# EAGLE design logicboard (EAGLE 7.5.0)

## Sheet 1 of 6: output interfaces
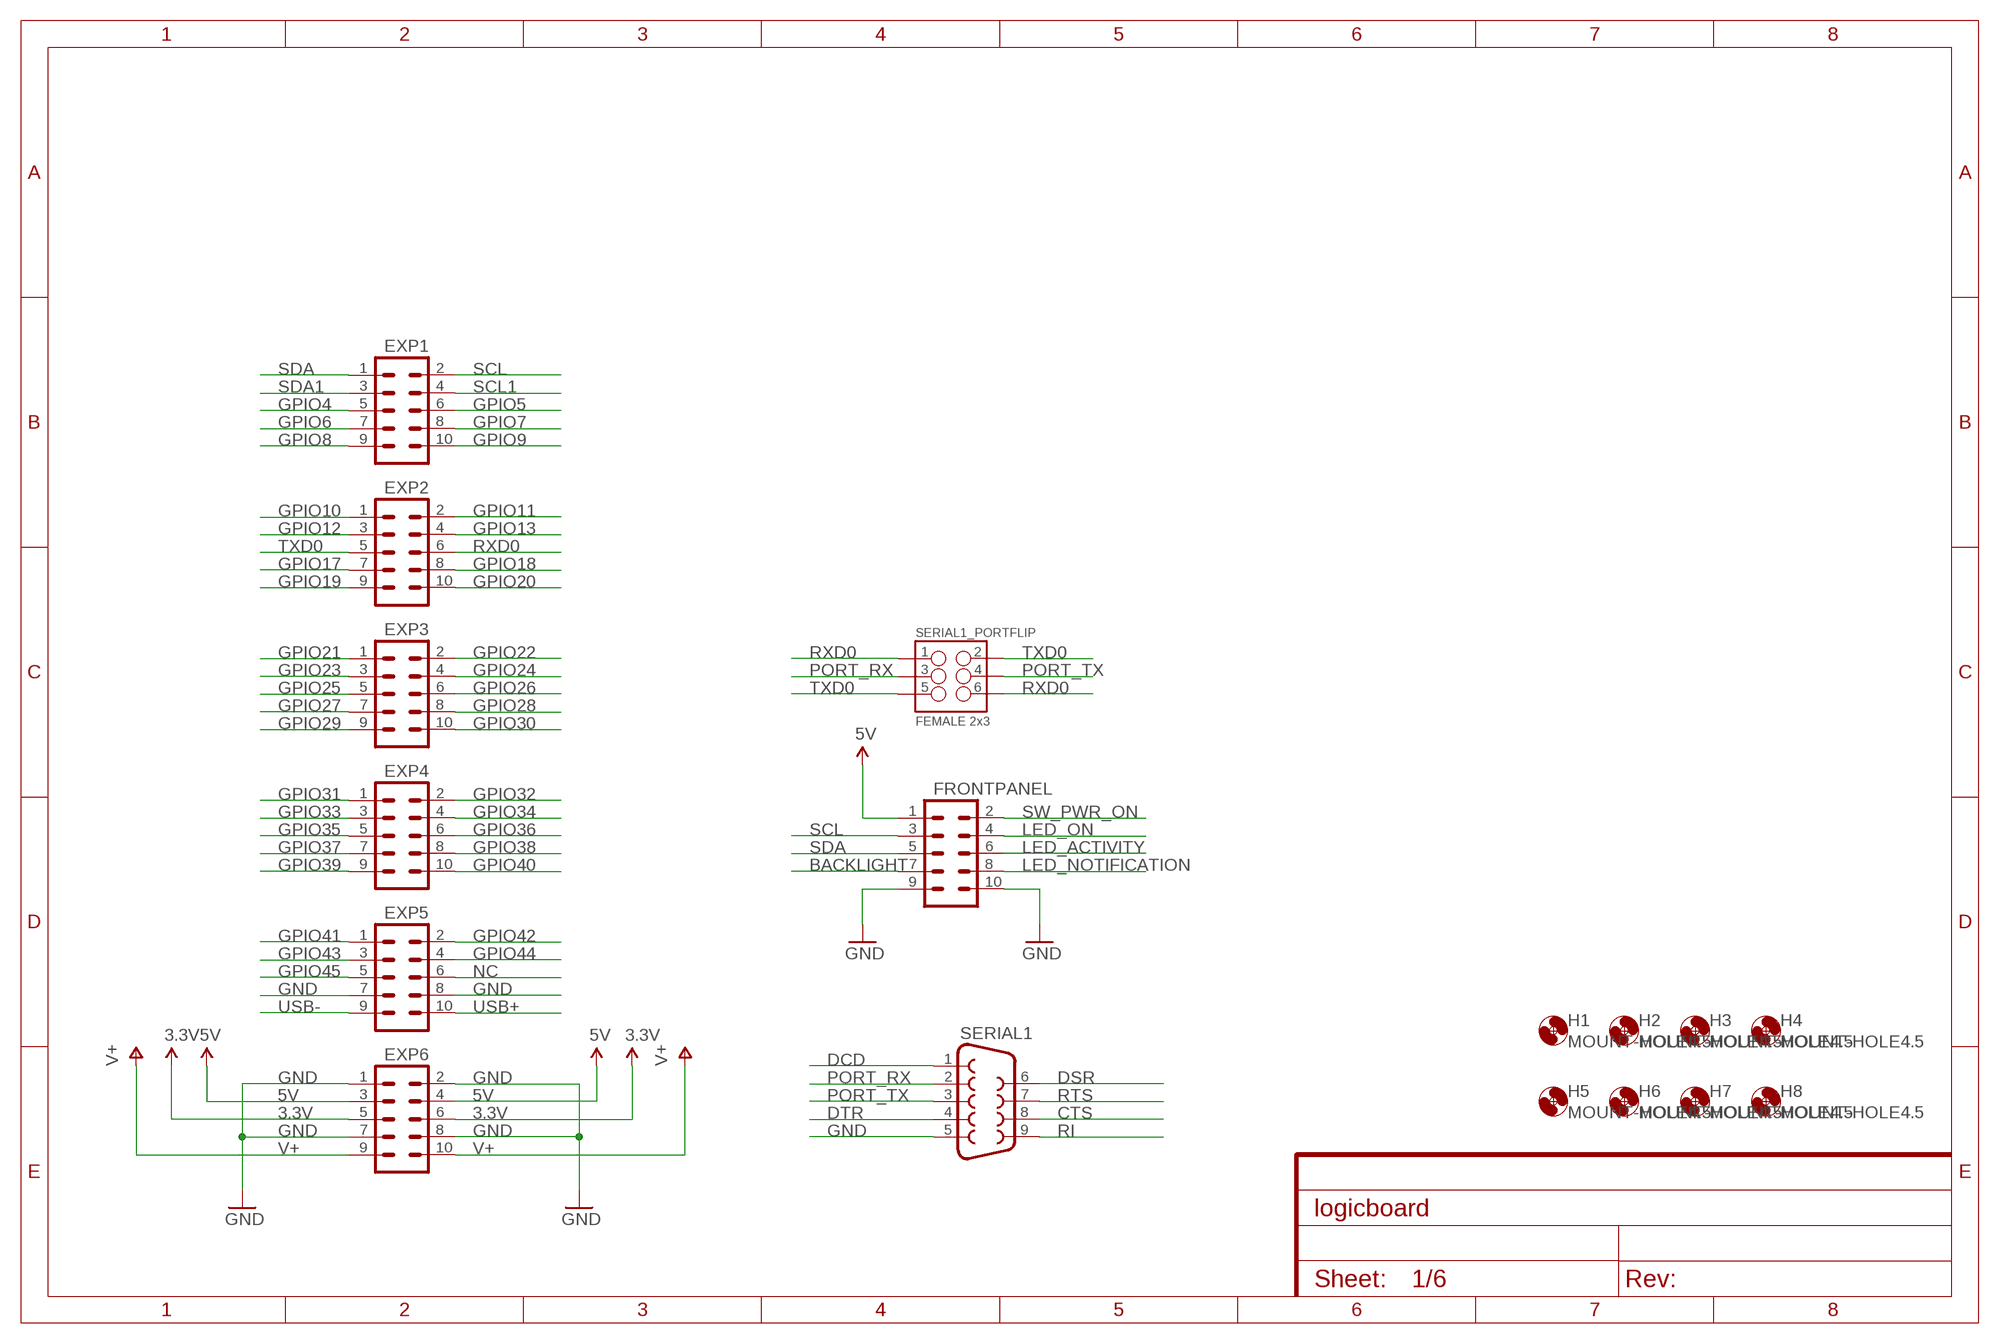
[diagram p0: schematic, sheet 1]

### Parts
EXP1  M05X2SHD_LOCK  [2X5-SHROUDED_LOCK]
EXP2  M05X2SHD_LOCK  [2X5-SHROUDED_LOCK]
EXP3  M05X2SHD_LOCK  [2X5-SHROUDED_LOCK]
EXP4  M05X2SHD_LOCK  [2X5-SHROUDED_LOCK]
EXP5  M05X2SHD_LOCK  [2X5-SHROUDED_LOCK]
EXP6  M05X2SHD_LOCK  [2X5-SHROUDED_LOCK]
FRONTPANEL  M05X2SHD_LOCK  [2X5-SHROUDED_LOCK]
H1  MOUNT-HOLE4.5  [4,5]
H2  MOUNT-HOLE4.5  [4,5]
H3  MOUNT-HOLE4.5  [4,5]
H4  MOUNT-HOLE4.5  [4,5]
H5  MOUNT-HOLE4.5  [4,5]
H6  MOUNT-HOLE4.5  [4,5]
H7  MOUNT-HOLE4.5  [4,5]
H8  MOUNT-HOLE4.5  [4,5]
SERIAL1  F09HP  [F09HP]
SERIAL1_PORTFLIP  FEMALE 2x3  M03X2FEMALE  [2X3]

### Nets
3.3V: EXP6.5 EXP6.6 ; also sheet 2,3,4,6
5V: EXP6.3 EXP6.4 FRONTPANEL.1 ; also sheet 2,4,5
BACKLIGHT: FRONTPANEL.7
CTS: SERIAL1.8
DCD: SERIAL1.1
DSR: SERIAL1.6
DTR: SERIAL1.4
GND: EXP5.7 EXP5.8 EXP6.1 EXP6.2 EXP6.7 EXP6.8 FRONTPANEL.9 FRONTPANEL.10 SERIAL1.5 ; also sheet 2,3,4,5,6
GPIO4: EXP1.5 ; also sheet 3
GPIO5: EXP1.6 ; also sheet 3
GPIO6: EXP1.7 ; also sheet 3
GPIO7: EXP1.8 ; also sheet 3
GPIO8: EXP1.9 ; also sheet 3
GPIO9: EXP1.10 ; also sheet 3
GPIO10: EXP2.1 ; also sheet 3
GPIO11: EXP2.2 ; also sheet 3
GPIO12: EXP2.3 ; also sheet 3
GPIO13: EXP2.4 ; also sheet 3
GPIO17: EXP2.7 ; also sheet 3
GPIO18: EXP2.8 ; also sheet 3
GPIO19: EXP2.9 ; also sheet 3
GPIO20: EXP2.10 ; also sheet 3
GPIO21: EXP3.1 ; also sheet 3
GPIO22: EXP3.2 ; also sheet 3
GPIO23: EXP3.3 ; also sheet 3
GPIO24: EXP3.4 ; also sheet 3
GPIO25: EXP3.5 ; also sheet 3
GPIO26: EXP3.6 ; also sheet 3
GPIO27: EXP3.7 ; also sheet 3
GPIO28: EXP3.8 ; also sheet 3
GPIO29: EXP3.9 ; also sheet 3
GPIO30: EXP3.10 ; also sheet 3
GPIO31: EXP4.1 ; also sheet 3
GPIO32: EXP4.2 ; also sheet 3
GPIO33: EXP4.3 ; also sheet 3
GPIO34: EXP4.4 ; also sheet 3
GPIO35: EXP4.5 ; also sheet 3
GPIO36: EXP4.6 ; also sheet 3
GPIO37: EXP4.7 ; also sheet 3
GPIO38: EXP4.8 ; also sheet 3
GPIO39: EXP4.9 ; also sheet 3
GPIO40: EXP4.10 ; also sheet 3,5
GPIO41: EXP5.1 ; also sheet 3,5
GPIO42: EXP5.2 ; also sheet 3
GPIO43: EXP5.3 ; also sheet 3
GPIO44: EXP5.4 ; also sheet 3
GPIO45: EXP5.5 ; also sheet 3
LED_ACTIVITY: FRONTPANEL.6
LED_NOTIFICATION: FRONTPANEL.8 ; also sheet 6
LED_ON: FRONTPANEL.4
NC: EXP5.6
PORT_RX: SERIAL1.2 SERIAL1_PORTFLIP.3
PORT_TX: SERIAL1.3 SERIAL1_PORTFLIP.4
RI: SERIAL1.9
RTS: SERIAL1.7
RXD0: EXP2.6 SERIAL1_PORTFLIP.1 SERIAL1_PORTFLIP.6 ; also sheet 3
SCL: EXP1.2 FRONTPANEL.3 ; also sheet 2,3,6
SCL1: EXP1.4 ; also sheet 3
SDA: EXP1.1 FRONTPANEL.5 ; also sheet 2,3,6
SDA1: EXP1.3 ; also sheet 3
SW_PWR_ON: FRONTPANEL.2
TXD0: EXP2.5 SERIAL1_PORTFLIP.2 SERIAL1_PORTFLIP.5 ; also sheet 3
USB+: EXP5.10 ; also sheet 3
USB-: EXP5.9 ; also sheet 3
V+: EXP6.9 EXP6.10 ; also sheet 4

## Sheet 2 of 6: i2c devices
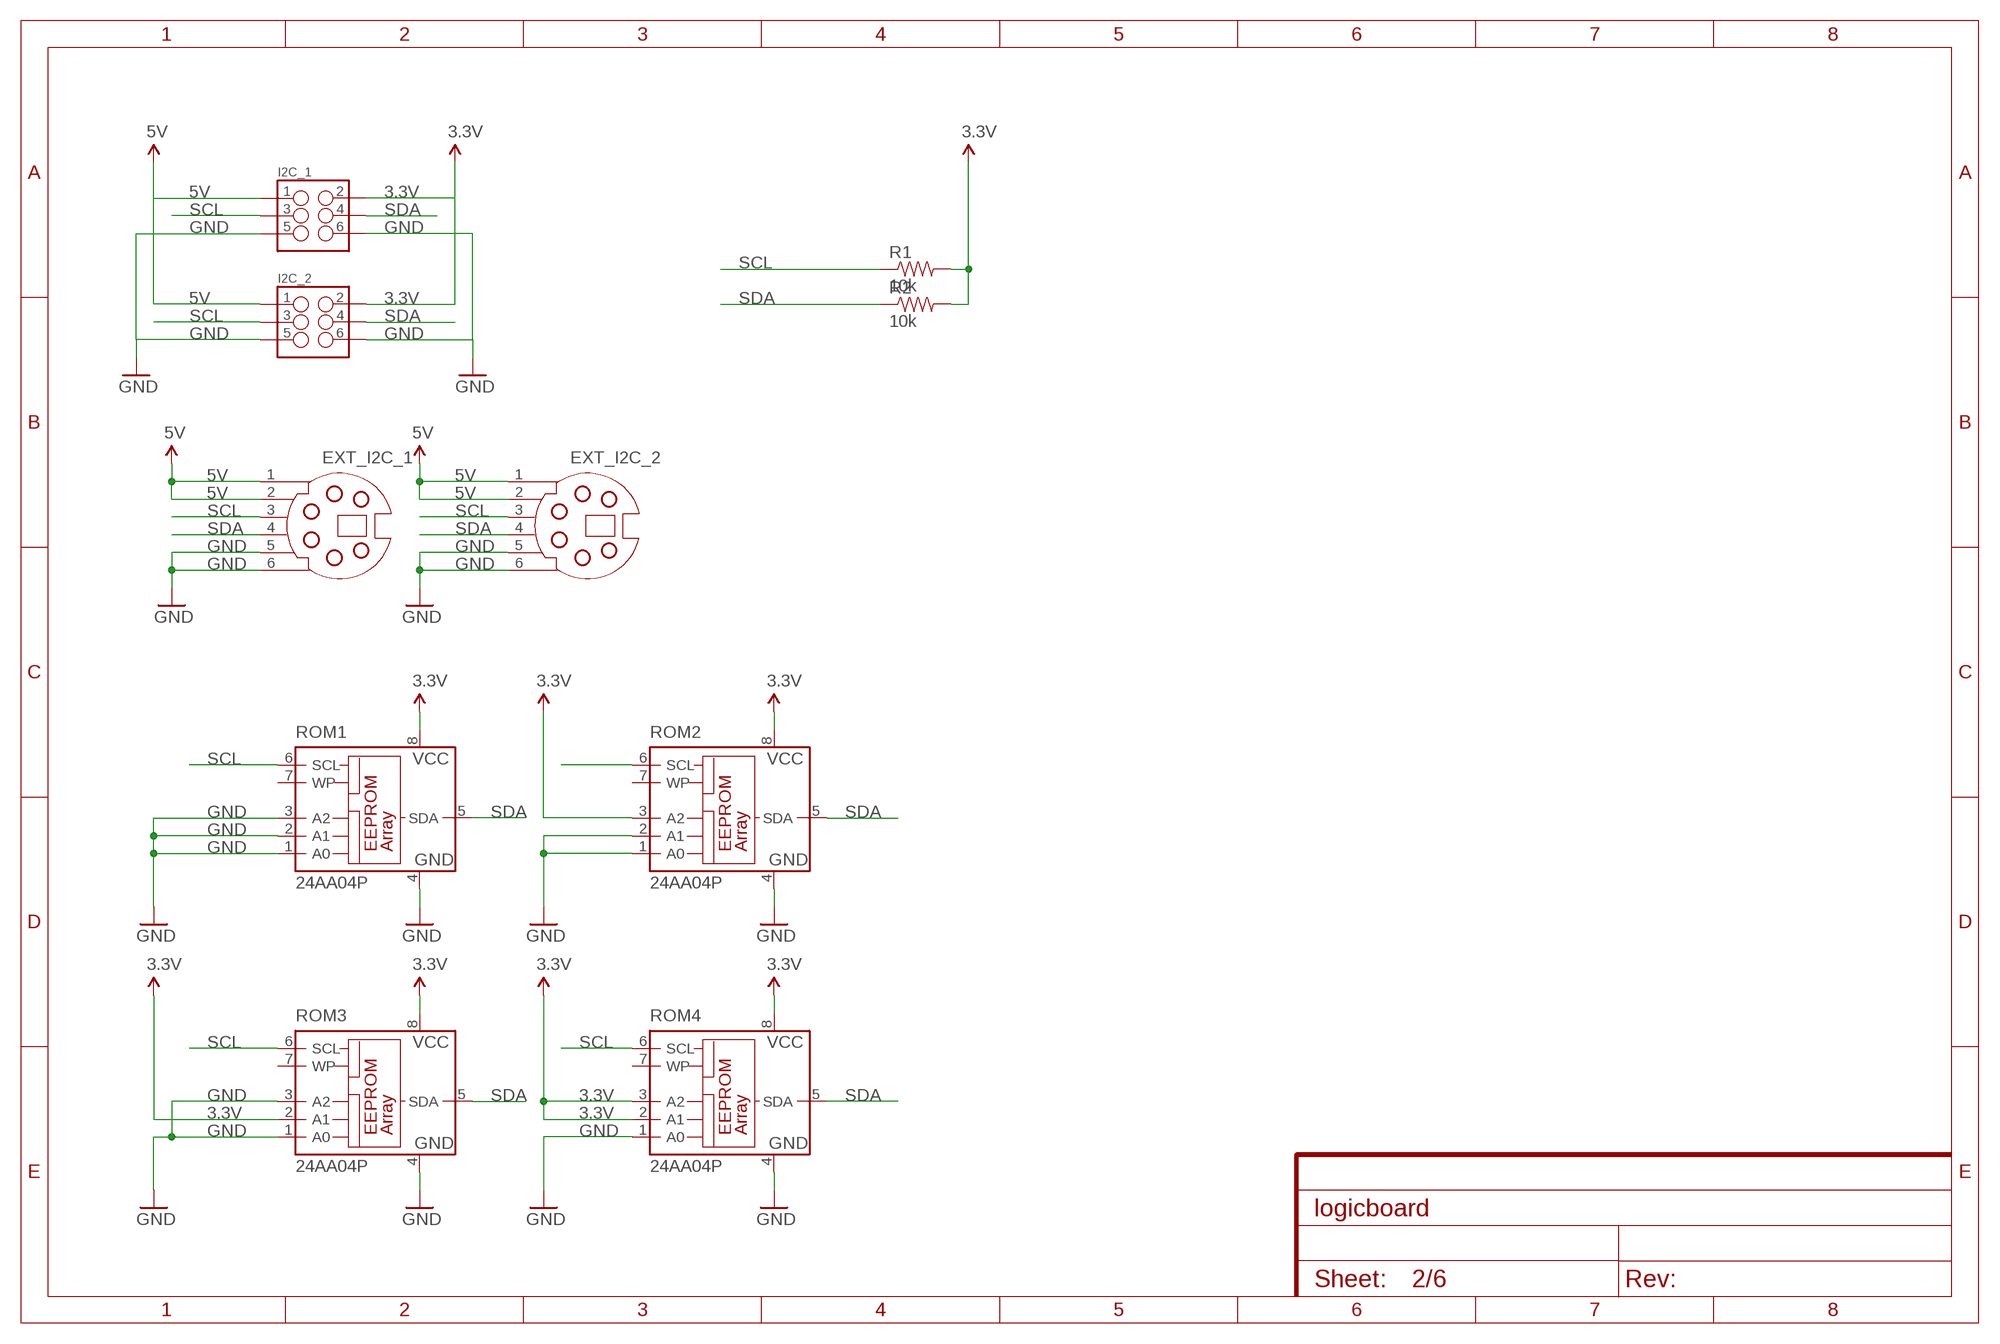
[diagram p1: schematic, sheet 2]

### Parts
EXT_I2C_1  MDSSV-BC06  [SSV-BC06]
EXT_I2C_2  MDSSV-BC06  [SSV-BC06]
I2C_1  M03X2SHROUD  [2X3-SHROUDED]
I2C_2  M03X2SHROUD  [2X3-SHROUDED]
R1  10k  10KOHM-1/4W-1%(PTH)HORIZ-KIT  [AXIAL-0.3EZ]
R2  10k  10KOHM-1/4W-1%(PTH)HORIZ-KIT  [AXIAL-0.3EZ]
ROM1  24AA04P  [DIL8]
ROM2  24AA04P  [DIL8]
ROM3  24AA04P  [DIL8]
ROM4  24AA04P  [DIL8]

### Nets
3.3V: I2C_1.2 I2C_2.2 R1.P$2 R2.P$2 ROM1.8(VCC) ROM2.3(A2) ROM2.8(VCC) ROM3.2(A1) ROM3.8(VCC) ROM4.2(A1) ROM4.3(A2) ROM4.8(VCC) ; also sheet 1,3,4,6
5V: EXT_I2C_1.1 EXT_I2C_1.2 EXT_I2C_2.1 EXT_I2C_2.2 I2C_1.1 I2C_2.1 ; also sheet 1,4,5
GND: EXT_I2C_1.5 EXT_I2C_1.6 EXT_I2C_2.5 EXT_I2C_2.6 I2C_1.5 I2C_1.6 I2C_2.5 I2C_2.6 ROM1.1(A0) ROM1.2(A1) ROM1.3(A2) ROM1.4(GND) ROM2.1(A0) ROM2.2(A1) ROM2.4(GND) ROM3.1(A0) ROM3.3(A2) ROM3.4(GND) ROM4.1(A0) ROM4.4(GND) ; also sheet 1,3,4,5,6
SCL: EXT_I2C_1.3 EXT_I2C_2.3 I2C_1.3 I2C_2.3 R1.P$1 ROM1.6(SCL) ROM2.6(SCL) ROM3.6(SCL) ROM4.6(SCL) ; also sheet 1,3,6
SDA: EXT_I2C_1.4 EXT_I2C_2.4 I2C_1.4 I2C_2.4 R2.P$1 ROM1.5(SDA) ROM2.5(SDA) ROM3.5(SDA) ROM4.5(SDA) ; also sheet 1,3,6
Unconnected: ROM1.7(WP) ROM2.7(WP) ROM3.7(WP) ROM4.7(WP)

## Sheet 3 of 6: Microprocessor card
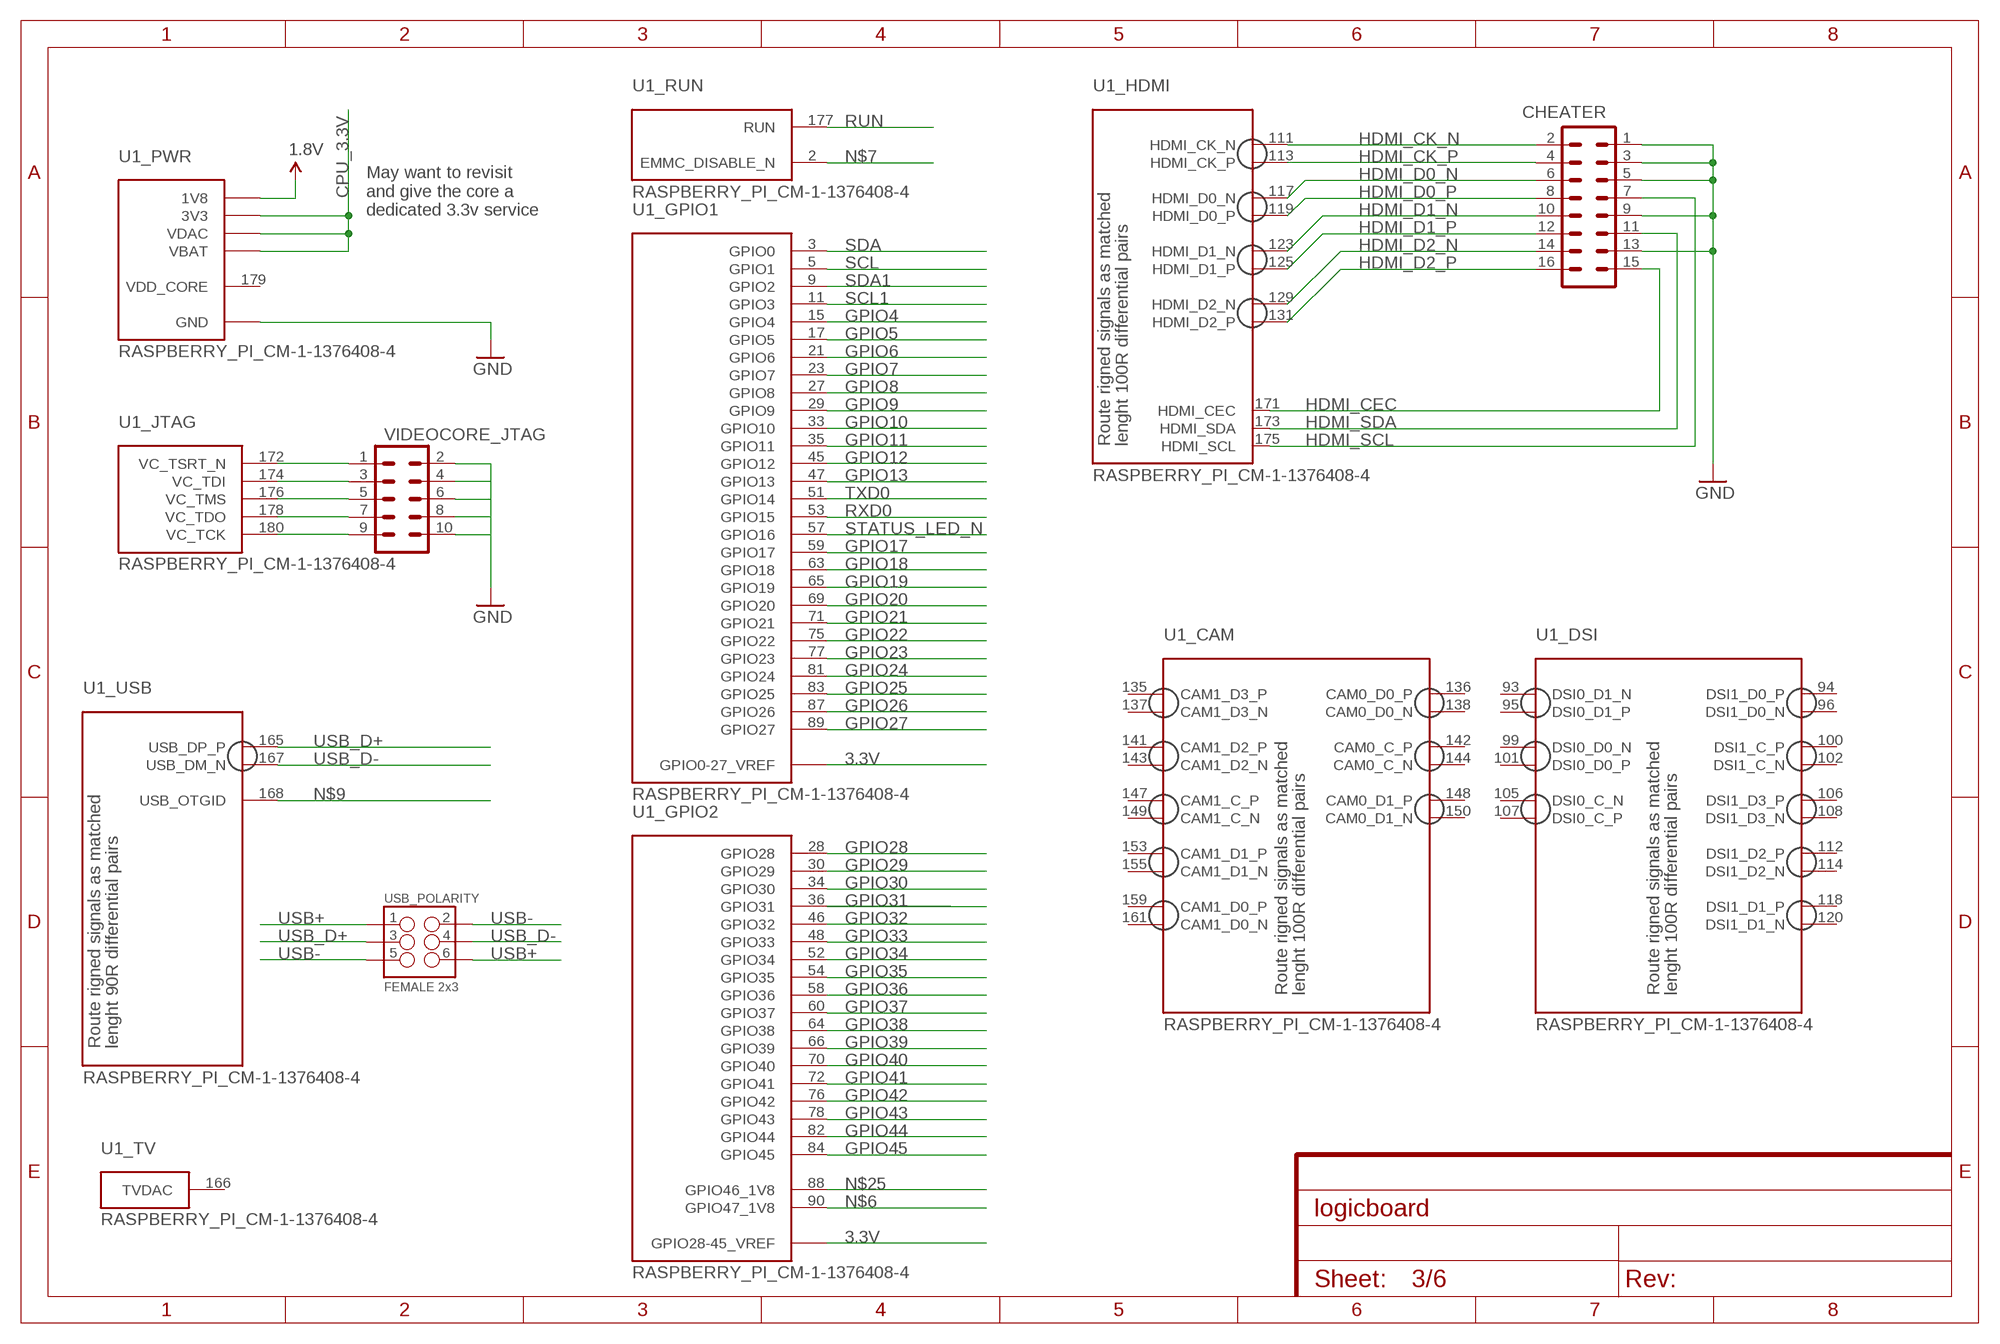
[diagram p2: schematic, sheet 3]

### Parts
CHEATER  M08X2  [2X8]
U1  RASPBERRY_PI_CM-1-1376408-4  [1-1376408-4]
USB_POLARITY  FEMALE 2x3  M03X2FEMALE  [2X3]
VIDEOCORE_JTAG  M05X2SHD_LOCK  [2X5-SHROUDED_LOCK]

### Nets
1.8V: U1.183(_PWR:1V8) U1.184(_PWR:1V8) U1.185(_PWR:1V8) U1.186(_PWR:1V8) ; also sheet 4
3.3V: U1.39(_GPIO1:GPIO0-27_VREF) U1.40(_GPIO1:GPIO0-27_VREF) U1.41(_GPIO2:GPIO28-45_VREF) U1.42(_GPIO2:GPIO28-45_VREF) ; also sheet 1,2,4,6
CPU_3.3V: U1.189(_PWR:VDAC) U1.190(_PWR:VDAC) U1.191(_PWR:3V3) U1.192(_PWR:3V3) U1.193(_PWR:3V3) U1.194(_PWR:3V3) U1.197(_PWR:VBAT) U1.198(_PWR:VBAT) U1.199(_PWR:VBAT) U1.200(_PWR:VBAT) ; also sheet 4
GND: CHEATER.1 CHEATER.3 CHEATER.5 CHEATER.9 CHEATER.13 U1.1(_PWR:GND) U1.7(_PWR:GND) U1.13(_PWR:GND) U1.19(_PWR:GND) U1.25(_PWR:GND) U1.26(_PWR:GND) U1.31(_PWR:GND) U1.32(_PWR:GND) U1.37(_PWR:GND) U1.38(_PWR:GND) U1.43(_PWR:GND) U1.44(_PWR:GND) U1.49(_PWR:GND) U1.50(_PWR:GND) U1.55(_PWR:GND) U1.56(_PWR:GND) U1.61(_PWR:GND) U1.62(_PWR:GND) U1.67(_PWR:GND) U1.68(_PWR:GND) U1.73(_PWR:GND) U1.74(_PWR:GND) U1.79(_PWR:GND) U1.80(_PWR:GND) U1.85(_PWR:GND) U1.86(_PWR:GND) U1.91(_PWR:GND) U1.92(_PWR:GND) U1.97(_PWR:GND) U1.98(_PWR:GND) U1.103(_PWR:GND) U1.104(_PWR:GND) U1.109(_PWR:GND) U1.110(_PWR:GND) U1.115(_PWR:GND) U1.116(_PWR:GND) U1.121(_PWR:GND) U1.122(_PWR:GND) U1.127(_PWR:GND) U1.133(_PWR:GND) U1.134(_PWR:GND) U1.139(_PWR:GND) U1.140(_PWR:GND) U1.145(_PWR:GND) U1.146(_PWR:GND) U1.151(_PWR:GND) U1.152(_PWR:GND) U1.157(_PWR:GND) U1.163(_PWR:GND) U1.164(_PWR:GND) U1.169(_PWR:GND) U1.170(_PWR:GND) U1.181(_PWR:GND) U1.182(_PWR:GND) U1.187(_PWR:GND) U1.188(_PWR:GND) U1.195(_PWR:GND) U1.196(_PWR:GND) VIDEOCORE_JTAG.2 VIDEOCORE_JTAG.4 VIDEOCORE_JTAG.6 VIDEOCORE_JTAG.8 VIDEOCORE_JTAG.10 ; also sheet 1,2,4,5,6
GPIO4: U1.15(_GPIO1:GPIO4) ; also sheet 1
GPIO5: U1.17(_GPIO1:GPIO5) ; also sheet 1
GPIO6: U1.21(_GPIO1:GPIO6) ; also sheet 1
GPIO7: U1.23(_GPIO1:GPIO7) ; also sheet 1
GPIO8: U1.27(_GPIO1:GPIO8) ; also sheet 1
GPIO9: U1.29(_GPIO1:GPIO9) ; also sheet 1
GPIO10: U1.33(_GPIO1:GPIO10) ; also sheet 1
GPIO11: U1.35(_GPIO1:GPIO11) ; also sheet 1
GPIO12: U1.45(_GPIO1:GPIO12) ; also sheet 1
GPIO13: U1.47(_GPIO1:GPIO13) ; also sheet 1
GPIO17: U1.59(_GPIO1:GPIO17) ; also sheet 1
GPIO18: U1.63(_GPIO1:GPIO18) ; also sheet 1
GPIO19: U1.65(_GPIO1:GPIO19) ; also sheet 1
GPIO20: U1.69(_GPIO1:GPIO20) ; also sheet 1
GPIO21: U1.71(_GPIO1:GPIO21) ; also sheet 1
GPIO22: U1.75(_GPIO1:GPIO22) ; also sheet 1
GPIO23: U1.77(_GPIO1:GPIO23) ; also sheet 1
GPIO24: U1.81(_GPIO1:GPIO24) ; also sheet 1
GPIO25: U1.83(_GPIO1:GPIO25) ; also sheet 1
GPIO26: U1.87(_GPIO1:GPIO26) ; also sheet 1
GPIO27: U1.89(_GPIO1:GPIO27) ; also sheet 1
GPIO28: U1.28(_GPIO2:GPIO28) ; also sheet 1
GPIO29: U1.30(_GPIO2:GPIO29) ; also sheet 1
GPIO30: U1.34(_GPIO2:GPIO30) ; also sheet 1
GPIO31: U1.36(_GPIO2:GPIO31) ; also sheet 1
GPIO32: U1.46(_GPIO2:GPIO32) ; also sheet 1
GPIO33: U1.48(_GPIO2:GPIO33) ; also sheet 1
GPIO34: U1.52(_GPIO2:GPIO34) ; also sheet 1
GPIO35: U1.54(_GPIO2:GPIO35) ; also sheet 1
GPIO36: U1.58(_GPIO2:GPIO36) ; also sheet 1
GPIO37: U1.60(_GPIO2:GPIO37) ; also sheet 1
GPIO38: U1.64(_GPIO2:GPIO38) ; also sheet 1
GPIO39: U1.66(_GPIO2:GPIO39) ; also sheet 1
GPIO40: U1.70(_GPIO2:GPIO40) ; also sheet 1,5
GPIO41: U1.72(_GPIO2:GPIO41) ; also sheet 1,5
GPIO42: U1.76(_GPIO2:GPIO42) ; also sheet 1
GPIO43: U1.78(_GPIO2:GPIO43) ; also sheet 1
GPIO44: U1.82(_GPIO2:GPIO44) ; also sheet 1
GPIO45: U1.84(_GPIO2:GPIO45) ; also sheet 1
HDMI_CEC: CHEATER.15 U1.171(_HDMI:HDMI_CEC)
HDMI_CK_N: CHEATER.2 U1.111(_HDMI:HDMI_CK_N)
HDMI_CK_P: CHEATER.4 U1.113(_HDMI:HDMI_CK_P)
HDMI_D0_N: CHEATER.6 U1.117(_HDMI:HDMI_D0_N)
HDMI_D0_P: CHEATER.8 U1.119(_HDMI:HDMI_D0_P)
HDMI_D1_N: CHEATER.10 U1.123(_HDMI:HDMI_D1_N)
HDMI_D1_P: CHEATER.12 U1.125(_HDMI:HDMI_D1_P)
HDMI_D2_N: CHEATER.14 U1.129(_HDMI:HDMI_D2_N)
HDMI_D2_P: CHEATER.16 U1.131(_HDMI:HDMI_D2_P)
HDMI_SCL: CHEATER.7 U1.175(_HDMI:HDMI_SCL)
HDMI_SDA: CHEATER.11 U1.173(_HDMI:HDMI_SDA)
N$1: U1.180(_JTAG:VC_TCK) VIDEOCORE_JTAG.9
N$2: U1.178(_JTAG:VC_TDO) VIDEOCORE_JTAG.7
N$3: U1.176(_JTAG:VC_TMS) VIDEOCORE_JTAG.5
N$4: U1.174(_JTAG:VC_TDI) VIDEOCORE_JTAG.3
N$5: U1.172(_JTAG:VC_TSRT_N) VIDEOCORE_JTAG.1
N$6: U1.90(_GPIO2:GPIO47_1V8)
N$7: U1.2(_RUN:EMMC_DISABLE_N)
N$9: U1.168(_USB:USB_OTGID)
N$25: U1.88(_GPIO2:GPIO46_1V8)
RUN: U1.177(_RUN:RUN)
RXD0: U1.53(_GPIO1:GPIO15) ; also sheet 1
SCL: U1.5(_GPIO1:GPIO1) ; also sheet 1,2,6
SCL1: U1.11(_GPIO1:GPIO3) ; also sheet 1
SDA: U1.3(_GPIO1:GPIO0) ; also sheet 1,2,6
SDA1: U1.9(_GPIO1:GPIO2) ; also sheet 1
STATUS_LED_N: U1.57(_GPIO1:GPIO16)
TXD0: U1.51(_GPIO1:GPIO14) ; also sheet 1
USB+: USB_POLARITY.1 USB_POLARITY.6 ; also sheet 1
USB-: USB_POLARITY.2 USB_POLARITY.5 ; also sheet 1
USB_D+: U1.165(_USB:USB_DP_P) USB_POLARITY.3
USB_D-: U1.167(_USB:USB_DM_N) USB_POLARITY.4
Unconnected: U1.93(_DSI:DSI0_D1_N) U1.94(_DSI:DSI1_D0_P) U1.95(_DSI:DSI0_D1_P) U1.96(_DSI:DSI1_D0_N) U1.99(_DSI:DSI0_D0_N) U1.100(_DSI:DSI1_C_P) U1.101(_DSI:DSI0_D0_P) U1.102(_DSI:DSI1_C_N) U1.105(_DSI:DSI0_C_N) U1.106(_DSI:DSI1_D3_P) U1.107(_DSI:DSI0_C_P) U1.108(_DSI:DSI1_D3_N) U1.112(_DSI:DSI1_D2_P) U1.114(_DSI:DSI1_D2_N) U1.118(_DSI:DSI1_D1_P) U1.120(_DSI:DSI1_D1_N) U1.135(_CAM:CAM1_D3_P) U1.136(_CAM:CAM0_D0_P) U1.137(_CAM:CAM1_D3_N) U1.138(_CAM:CAM0_D0_N) U1.141(_CAM:CAM1_D2_P) U1.142(_CAM:CAM0_C_P) U1.143(_CAM:CAM1_D2_N) U1.144(_CAM:CAM0_C_N) U1.147(_CAM:CAM1_C_P) U1.148(_CAM:CAM0_D1_P) U1.149(_CAM:CAM1_C_N) U1.150(_CAM:CAM0_D1_N) U1.153(_CAM:CAM1_D1_P) U1.155(_CAM:CAM1_D1_N) U1.159(_CAM:CAM1_D0_P) U1.161(_CAM:CAM1_D0_N) U1.166(_TV:TVDAC) U1.179(_PWR:VDD_CORE)

### Notes on the sheet
- May want to revisit 
  and give the core a 
  dedicated 3.3v service

## Sheet 4 of 6: Power Regulation
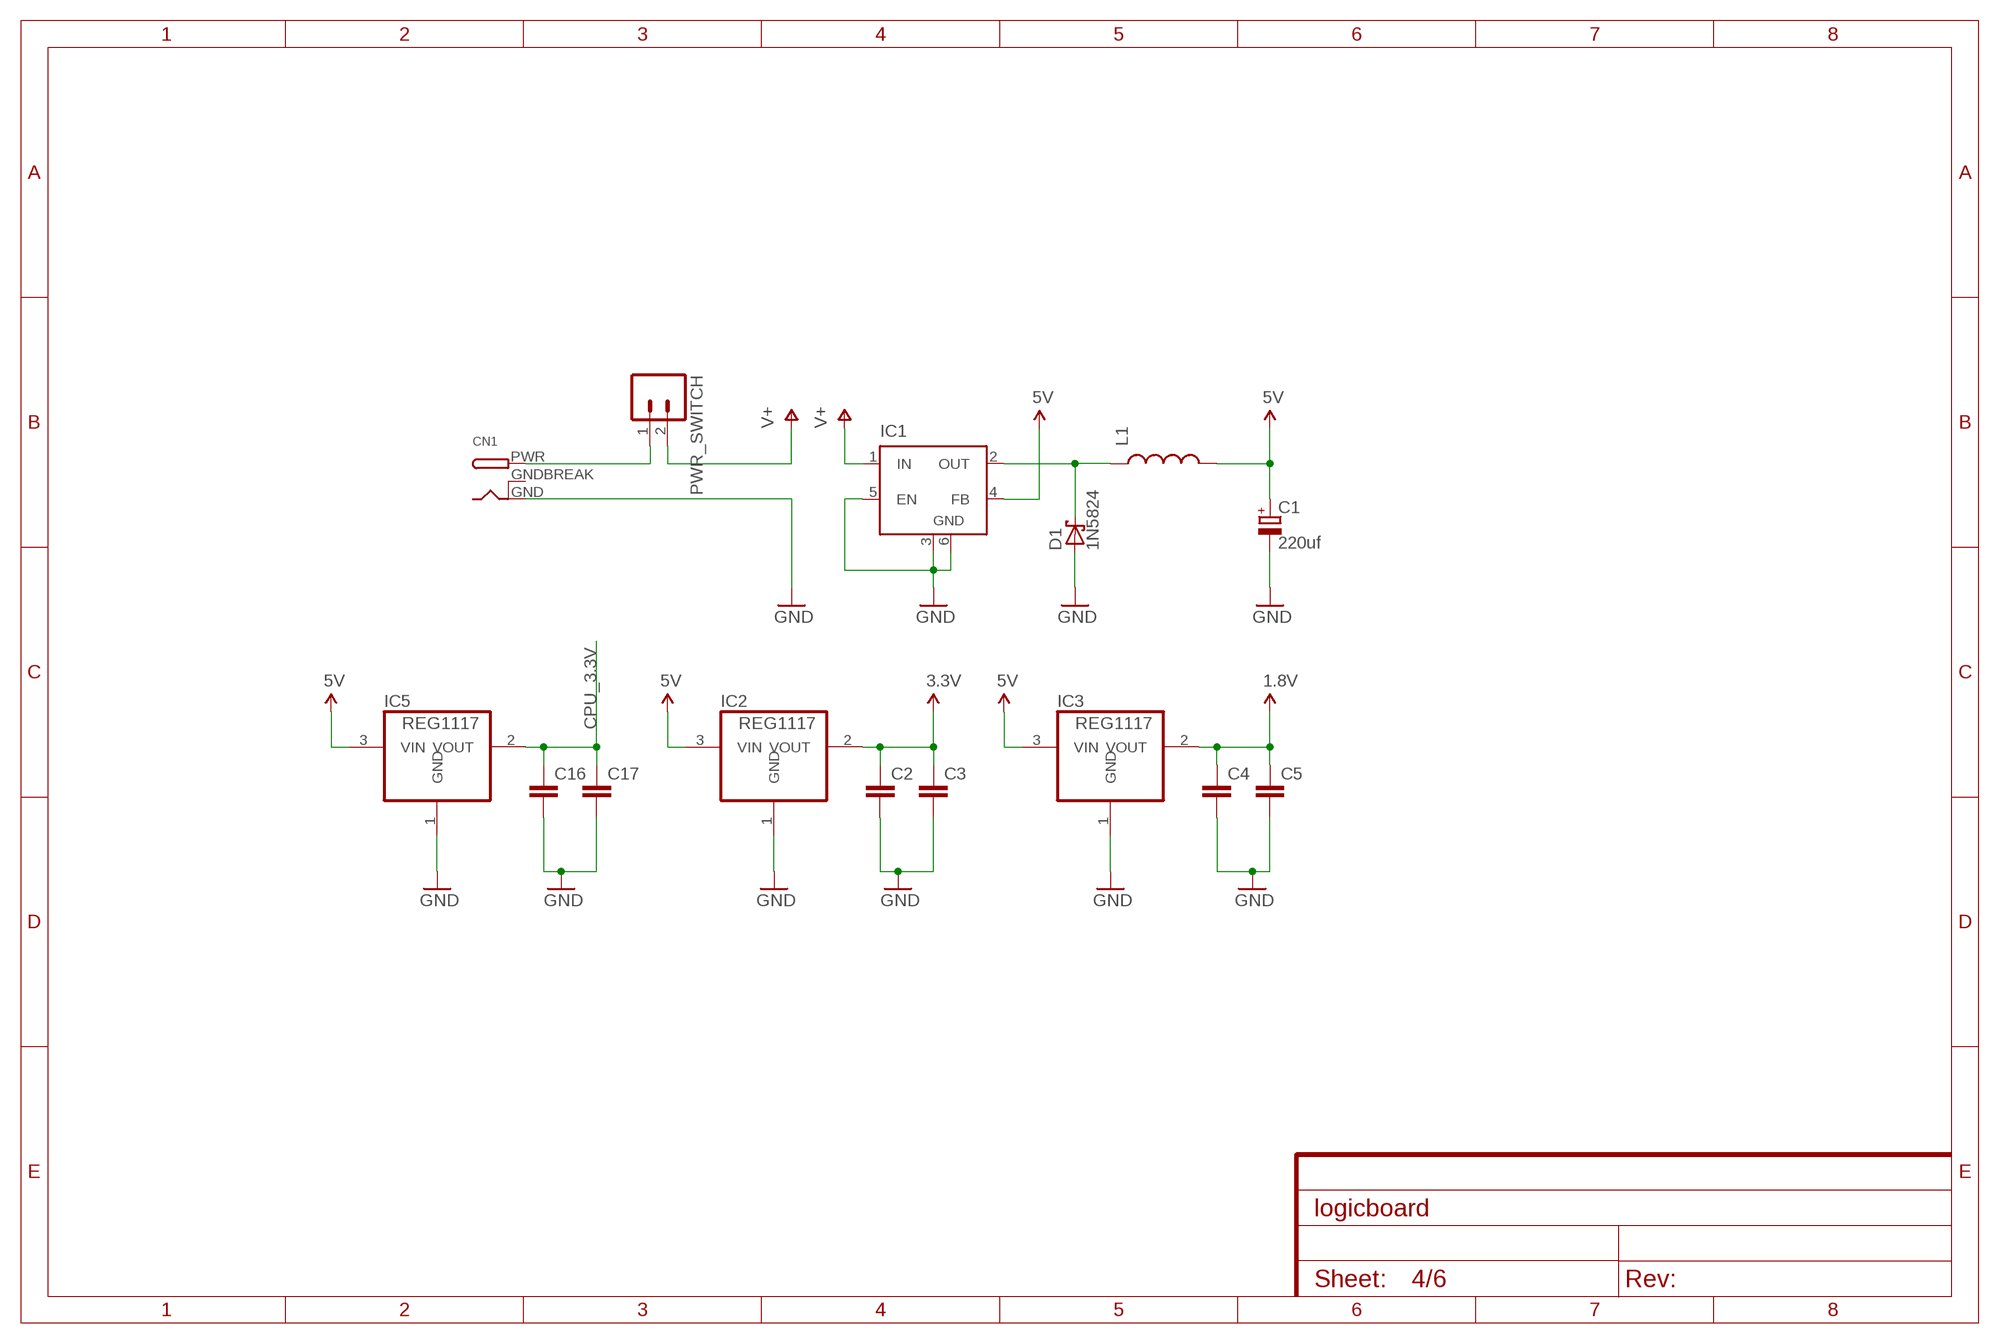
[diagram p3: schematic, sheet 4]

### Parts
C1  220uf  CPOL-EUE2.5-6  [E2,5-6]
C2  CAP1206  [1206]
C3  CAP1206  [1206]
C4  CAP1206  [1206]
C5  CAP1206  [1206]
C16  CAP1206  [1206]
C17  CAP1206  [1206]
CN1  DCBARRELPTH  [DCJACK_2MM_PTH]
D1  1N5824  1N5817-B  [DO41-7.6]
IC1  LM2596S  [TO263-5]
IC2  REG1117  [SOT223]
IC3  REG1117  [SOT223]
IC5  REG1117  [SOT223]
L1  INDUCTORSRU1038  [SRU1038]
PWR_SWITCH  M02POLAR  [MOLEX-1X2]

### Nets
1.8V: C4.1 C5.1 IC3.2(VOUT) ; also sheet 3
3.3V: C2.1 C3.1 IC2.2(VOUT) ; also sheet 1,2,3,6
5V: C1.+ IC1.4(FB) IC2.3(VIN) IC3.3(VIN) IC5.3(VIN) L1.2 ; also sheet 1,2,5
CPU_3.3V: C16.1 C17.1 IC5.2(VOUT) ; also sheet 3
GND: C1.- C2.2 C3.2 C4.2 C5.2 C16.2 C17.2 CN1.GND D1.A IC1.3(GND) IC1.5(EN) IC1.6(GND) IC2.1(GND) IC3.1(GND) IC5.1(GND) ; also sheet 1,2,3,5,6
N$8: CN1.PWR PWR_SWITCH.1
V+: IC1.1(IN) PWR_SWITCH.2 ; also sheet 1
VOUT: D1.C IC1.2(OUT) L1.1

## Sheet 5 of 6: Audio
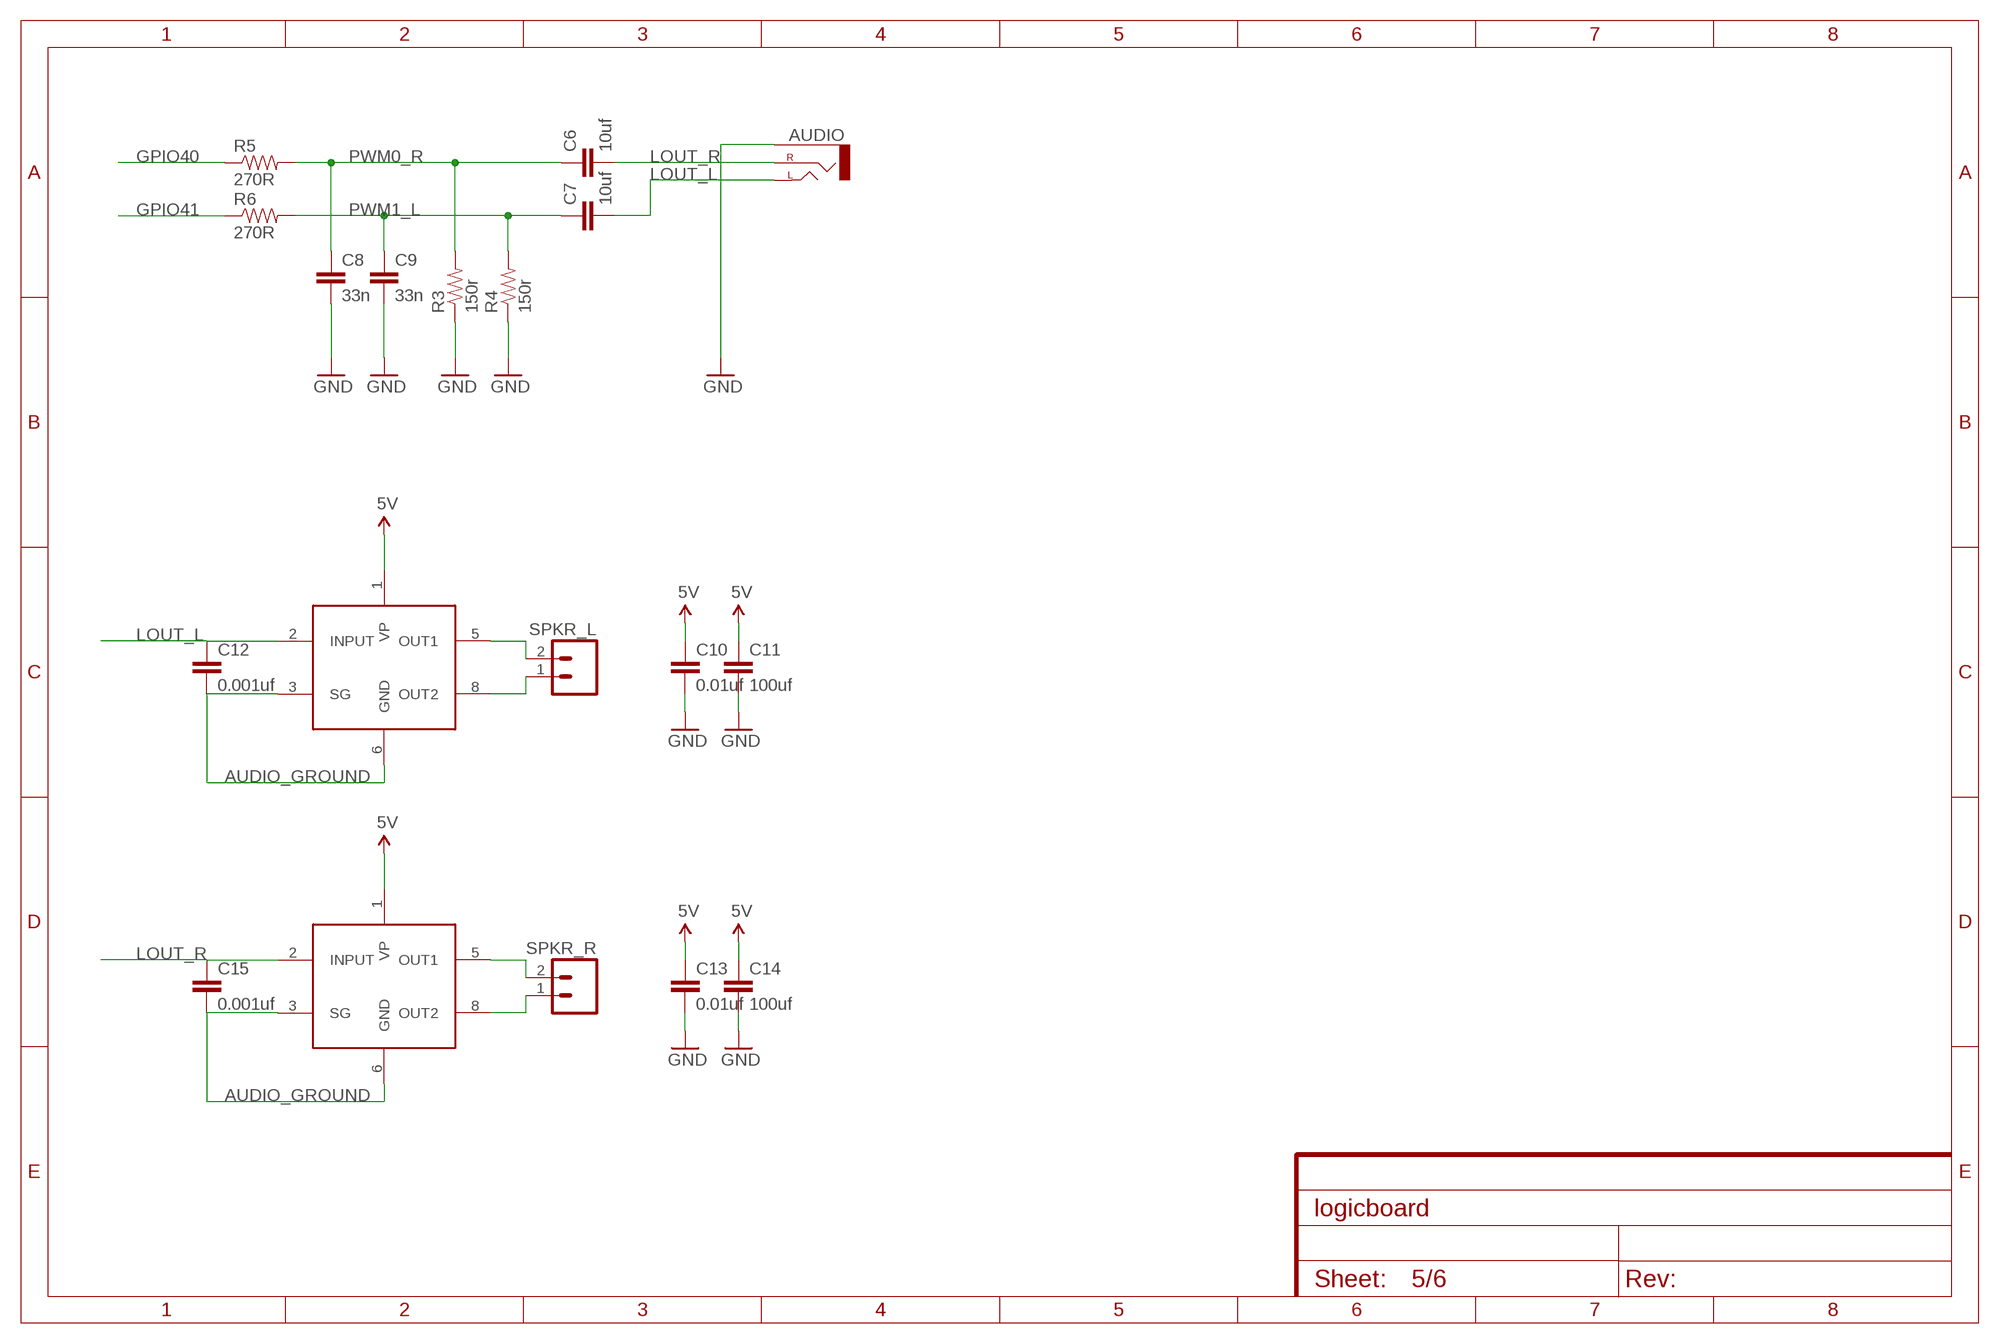
[diagram p4: schematic, sheet 5]

### Parts
AUDIO  AUDIO-JACKPTH  [AUDIO-JACK]
C6  10uf  CAPEZ  [CAP-PTH-SMALLEZ]
C7  10uf  CAPEZ  [CAP-PTH-SMALLEZ]
C8  33n  CAPEZ  [CAP-PTH-SMALLEZ]
C9  33n  CAPEZ  [CAP-PTH-SMALLEZ]
C10  0.01uf  CAPEZ  [CAP-PTH-SMALLEZ]
C11  100uf  CAPEZ  [CAP-PTH-SMALLEZ]
C12  0.001uf  CAPEZ  [CAP-PTH-SMALLEZ]
C13  0.01uf  CAPEZ  [CAP-PTH-SMALLEZ]
C14  100uf  CAPEZ  [CAP-PTH-SMALLEZ]
C15  0.001uf  CAPEZ  [CAP-PTH-SMALLEZ]
R3  150r  RESISTOREZ  [AXIAL-0.3EZ]
R4  150r  RESISTOREZ  [AXIAL-0.3EZ]
R5  270R  RESISTOREZ  [AXIAL-0.3EZ]
R6  270R  RESISTOREZ  [AXIAL-0.3EZ]
SPKR_L  M02JST-PTH-2-KIT  [JST-2-PTH-KIT]
SPKR_R  M02JST-PTH-2-KIT  [JST-2-PTH-KIT]
U$1  TDA7052  [DIL08]
U$2  TDA7052  [DIL08]

### Nets
5V: C10.1 C11.1 C13.1 C14.1 U$1.1(VP) U$2.1(VP) ; also sheet 1,2,4
AUDIO_GROUND: C12.2 C15.2 U$1.3(SG) U$1.6(GND) U$2.3(SG) U$2.6(GND) ; also sheet 6
GND: AUDIO.SLEEVE C8.2 C9.2 C10.2 C11.2 C13.2 C14.2 R3.P$1 R4.P$1 ; also sheet 1,2,3,4,6
GPIO40: R5.P$1 ; also sheet 1,3
GPIO41: R6.P$1 ; also sheet 1,3
LOUT_L: AUDIO.TIP(LEFT) C7.2 C12.1 U$1.2(INPUT)
LOUT_R: AUDIO.RING(RIGHT) C6.2 C15.1 U$2.2(INPUT)
N$10: SPKR_L.2 U$1.5(OUT1)
N$11: SPKR_L.1 U$1.8(OUT2)
N$22: SPKR_R.2 U$2.5(OUT1)
N$23: SPKR_R.1 U$2.8(OUT2)
PWM0_R: C6.1 C8.1 R3.P$2 R5.P$2
PWM1_L: C7.1 C9.1 R4.P$2 R6.P$2

## Sheet 6 of 6
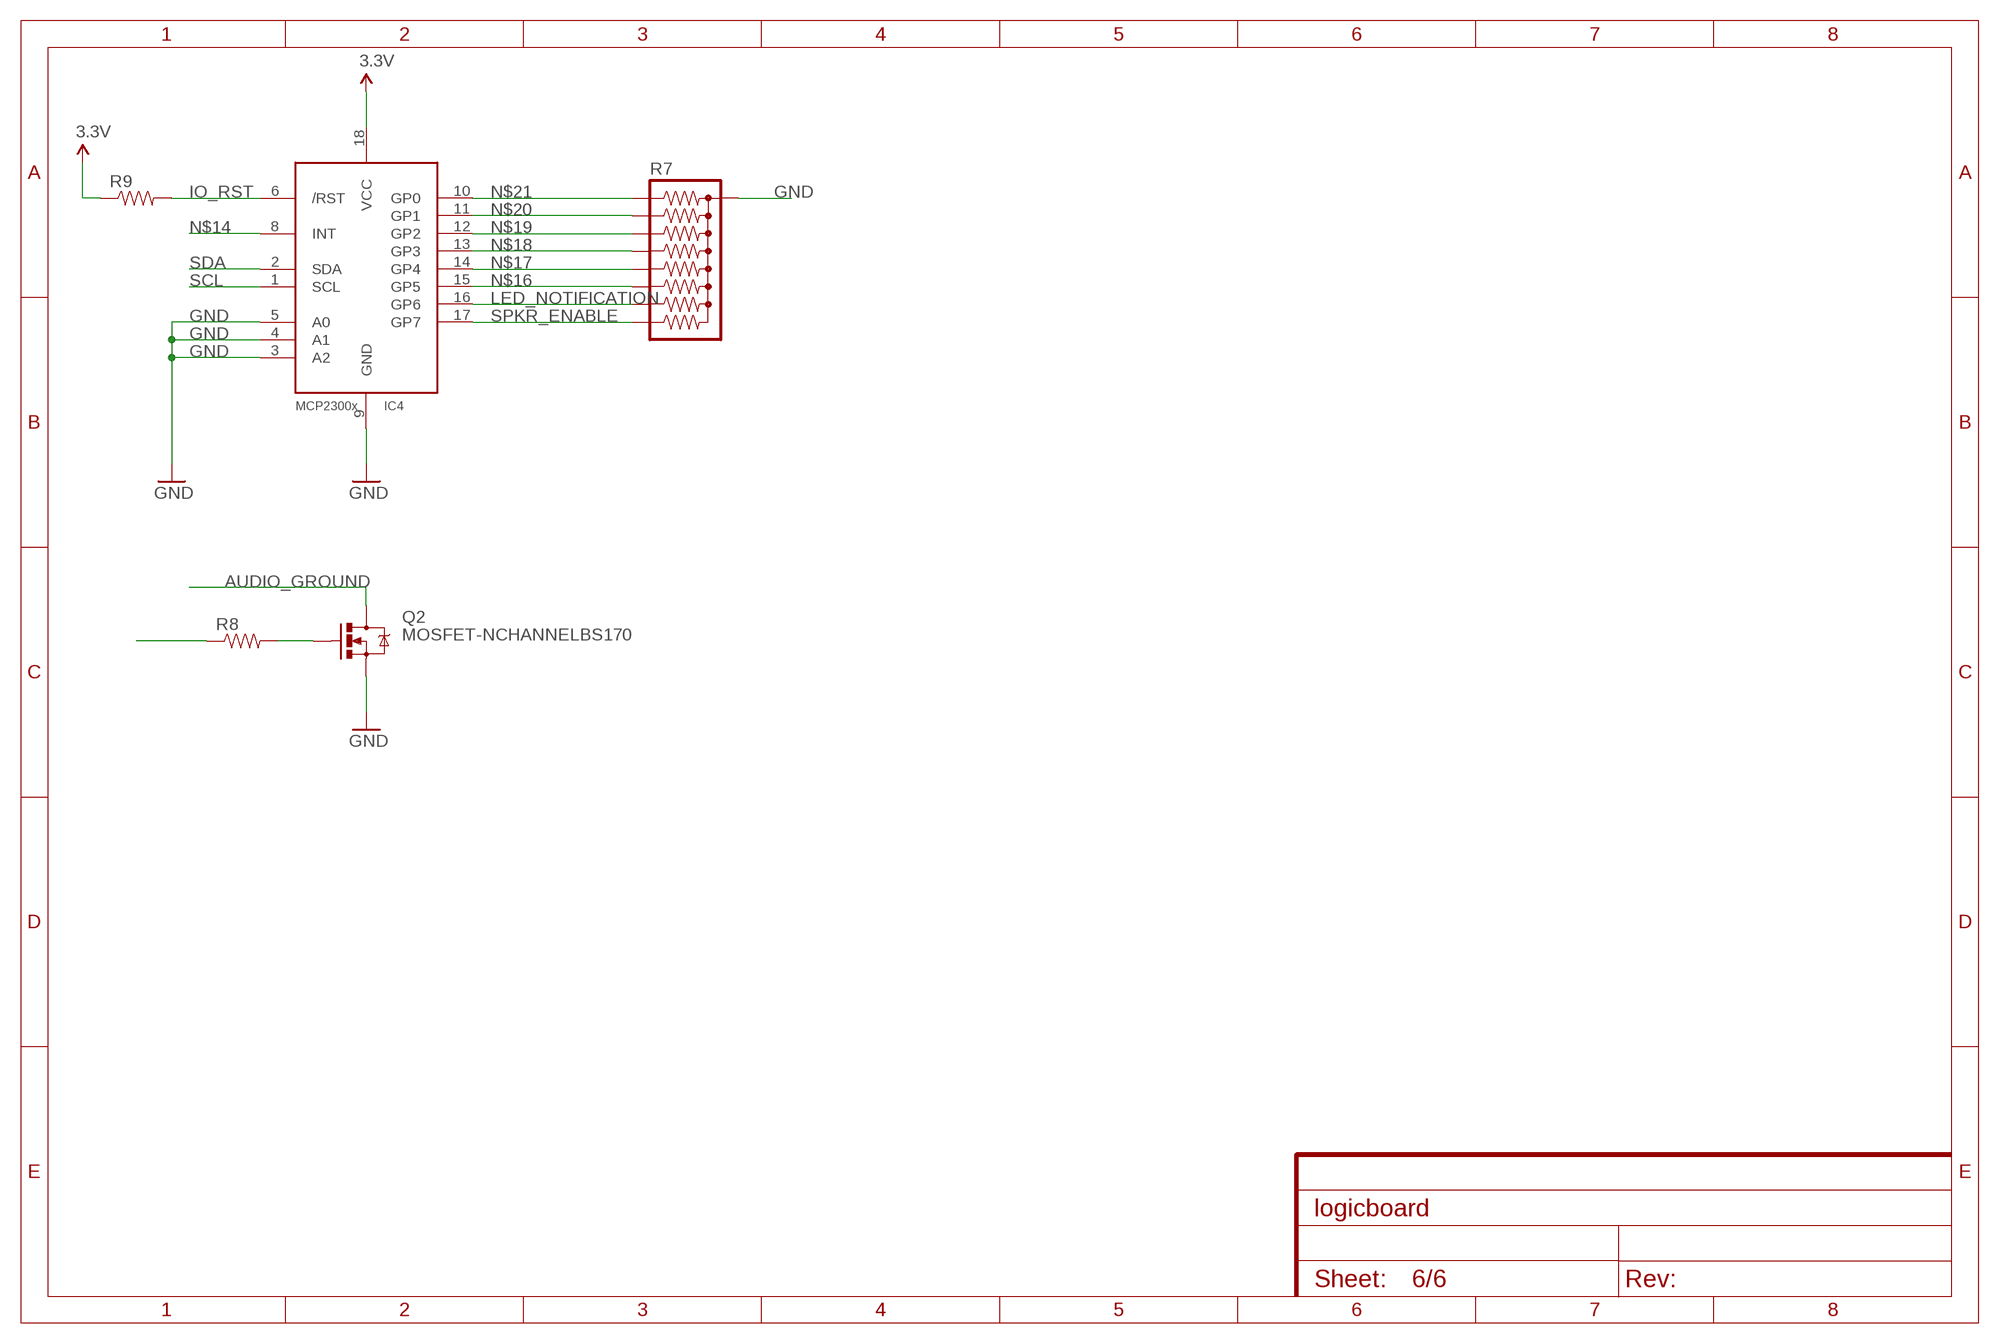
[diagram p5: schematic, sheet 6]

### Parts
IC4  MCP2300X/P  [DIL18]
Q2  MOSFET-NCHANNELBS170  [TO-92]
R7  RPACK-BUSSED-8-SIP-PTH-8  [RPACK-SIP-PTH-8]
R8  RESISTOREZ  [AXIAL-0.3EZ]
R9  RESISTOREZ  [AXIAL-0.3EZ]

### Nets
3.3V: IC4.18(VCC) R9.P$1 ; also sheet 1,2,3,4
AUDIO_GROUND: Q2.1(D) ; also sheet 5
GND: IC4.3(A2) IC4.4(A1) IC4.5(A0) IC4.9(GND) Q2.3(S) R7.P$1 ; also sheet 1,2,3,4,5
IO_RST: IC4.6(/RST) R9.P$2
LED_NOTIFICATION: IC4.16(GP6) R7.P$8 ; also sheet 1
N$12: Q2.2(G) R8.P$2
N$14: IC4.8(INT)
N$16: IC4.15(GP5) R7.P$7
N$17: IC4.14(GP4) R7.P$6
N$18: IC4.13(GP3) R7.P$5
N$19: IC4.12(GP2) R7.P$4
N$20: IC4.11(GP1) R7.P$3
N$21: IC4.10(GP0) R7.P$2
SCL: IC4.1(SCL) ; also sheet 1,2,3
SDA: IC4.2(SDA) ; also sheet 1,2,3
SPKR_ENABLE: IC4.17(GP7) R7.P$9 R8.P$1

## Power pins joined to a net without a drawn wire
GNDBREAK: CN1.GNDBREAK

## Library data of the parts
AUDIO = SparkFun-Connectors:AUDIO-JACK: 3.5mm Audio Jack Simple 3.5mm common PCB mount audio jack. Variant PTH is our storefront SKU PRT-08032
C1 = rcl:CPOL-EU: POLARIZED CAPACITOR, European symbol
C2-C17 = SparkFun-Capacitors:CAP: Capacitor Standard 0603 ceramic capacitor, and 0.1" leaded capacitor.
CHEATER = SparkFun-Connectors:M08X2: .1" headers, two rows of 8 each
CN1 = adafruit:DCBARREL: 2.0mm DC Barrel Jack DCJACK_2MM_PTH - Through Hole Jack (4UConnector: 05537)
D1 = diode:1N581*: 1.0A SCHOTTKY BARRIER RECTIFIER Source: http://www.diodes.com/datasheets/ds23001.pdf
EXP1-EXP6 FRONTPANEL VIDEOCORE_JTAG = SparkFun-Connectors:M05X2: Header 5x2 Standard 10-pin dual row 0.1" header. Commonly used with AVR-ISP. Use with Spark Fun Electronics SKU: PRT-00778
EXT_I2C_1 EXT_I2C_2 = con-yamaichi:MDSSV-BC06: YAMAICHI CONNECTOR; OC_FARNELL: unknown; OC_NEWARK: unknown
H1-H8 = holes:MOUNT-HOLE: MOUNTING HOLE with drill center marker
I2C_1 I2C_2 = SparkFun-Connectors:M03X2: 2x3 .1" header. Shrouded, with keying- CONN-10681 SMT- CONN-11415 Pogo pins- HW-11044; PROD_ID: CONN-10681
IC1 = linear:LM2596S: STEP-DOWN VOLTAGE REGULATOR
IC2 IC3 IC5 = burr-brown:REG1117: 800mA and 1A Low Dropout (LDO) Positive Regulator 1.8V, 2.5V, 2.85V, 3.3V, 5V, and Adj; MPN: REG1117; OC_FARNELL: 1097566; OC_NEWARK: 14P6981
IC4 = adafruit:MCP2300X: MCP23008 Inexpensive i2c i/o expander - 8 general purpose i/o pins with optional pullups
L1 = SparkFun-Passives:INDUCTOR: Inductors Basic Inductor/Choke - 0603 and 1206. Footprints are not proven and vary greatly between part numbers. SRN6045- 33uH, 20% 1.4A SDR0403-560KL - 56uH, 10%, 500mA RMS/740mA peak
PWR_SWITCH SPKR_L SPKR_R = SparkFun-Connectors:M02: Standard 2-pin 0.1" header. Use with - straight break away headers ( PRT-00116) - right angle break away headers (PRT-00553) - swiss pins (PRT-00743) - machine pins (PRT-00117) - female headers (PRT-00115) Molex polarized connector foot print use with: PRT-08233 with associated crimp pins and housings. 2.54_SCREWTERM for use with PRT-10571. 3.5mm Screw Terminal footprints for PRT-08084 5mm Screw Terminal footprints for use with PRT-08432
Q2 = SparkFun-DiscreteSemi:MOSFET-NCHANNEL: Common NMOSFET Parts MFG P/N Store ID Prod ID FDD8780 TRANS-09984 SI7820DN TRANS-11055 FDS6630A IC-08089 2N7002PW TRANS-11151 FQP30N06L COM-10213 TRANS-10060 BSS123LT1G TRANS-08345 BSS138 TRANS-00830 BS170 2N7000
R1 R2 = SparkFun-Resistors:10KOHM-1/4W-1%(PTH): RES-12183; PROD_ID: RES-12183
R3-R6 R8 R9 = SparkFun-Resistors:RESISTOR: Resistor Basic schematic elements and footprints for 0603, 1206, and PTH resistors.
R7 = SparkFun-Resistors:RPACK-BUSSED-8: BOURNS 4600X/R series thick-film SIP resistor packs Height resistors bussed to a single pin (denoted by dot). datasheet <http://dlnmh9ip6v2uc.cloudfront.net/datasheets/Components/General/4600x.pdf> SIMILAR TO: SFE parts COM-10855 (330), COM-10856 (10K)
ROM1-ROM4 = microchip:24*: Serial EEPROM I2C; MPN: 24AA04-I/P; OC_FARNELL: 1331275; OC_NEWARK: 35M0696
SERIAL1 = con-subd:F09: SUB-D; OC_FARNELL: unknown; OC_NEWARK: unknown
SERIAL1_PORTFLIP USB_POLARITY = SparkFun-Connectors:M03X2: 2x3 .1" header. Shrouded, with keying- CONN-10681 SMT- CONN-11415 Pogo pins- HW-11044; PROD_ID: CONN-11566
U1 = Ciseco%20Pi%20Compute%20Module:RASPBERRY_PI_CM: Raspberry Pi Compute Module As anounced in this blog post http://www.raspberrypi.org/raspberry-pi-compute-module-new-product/ Based on infomation from this schematic http://www.raspberrypi.org/wp-content/uploads/2014/04/RPI-CM-V1_1-SCHEMATIC.pdf Footprint is unproven and no matching part confimed as of yet
U$1 U$2 = tda7052:TDA7052: 1W Mono audio amplifier

## Board
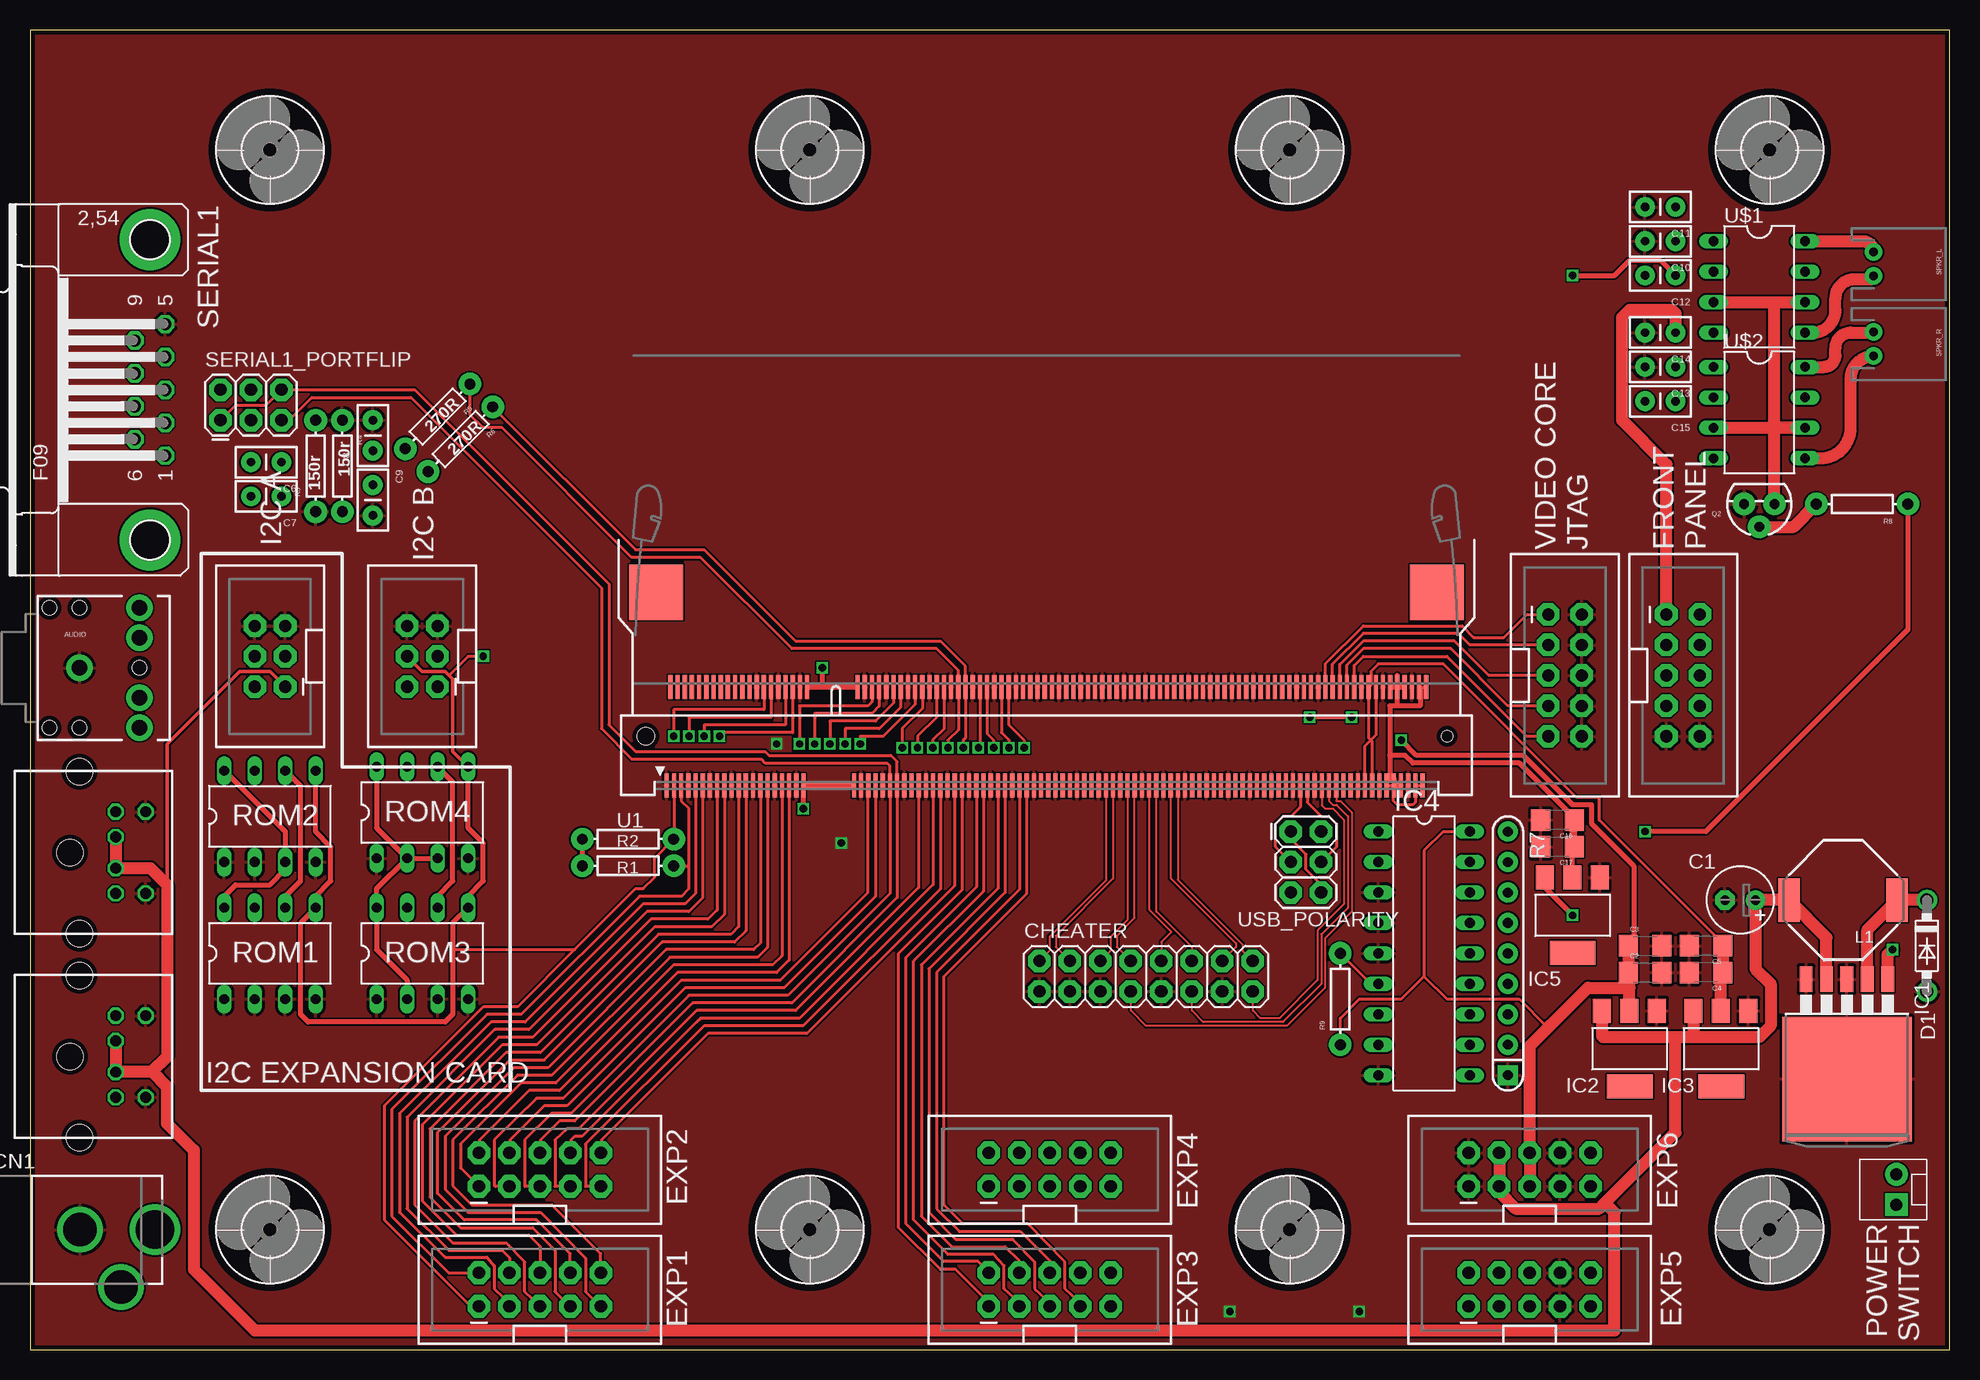
[diagram p6: board, top side]
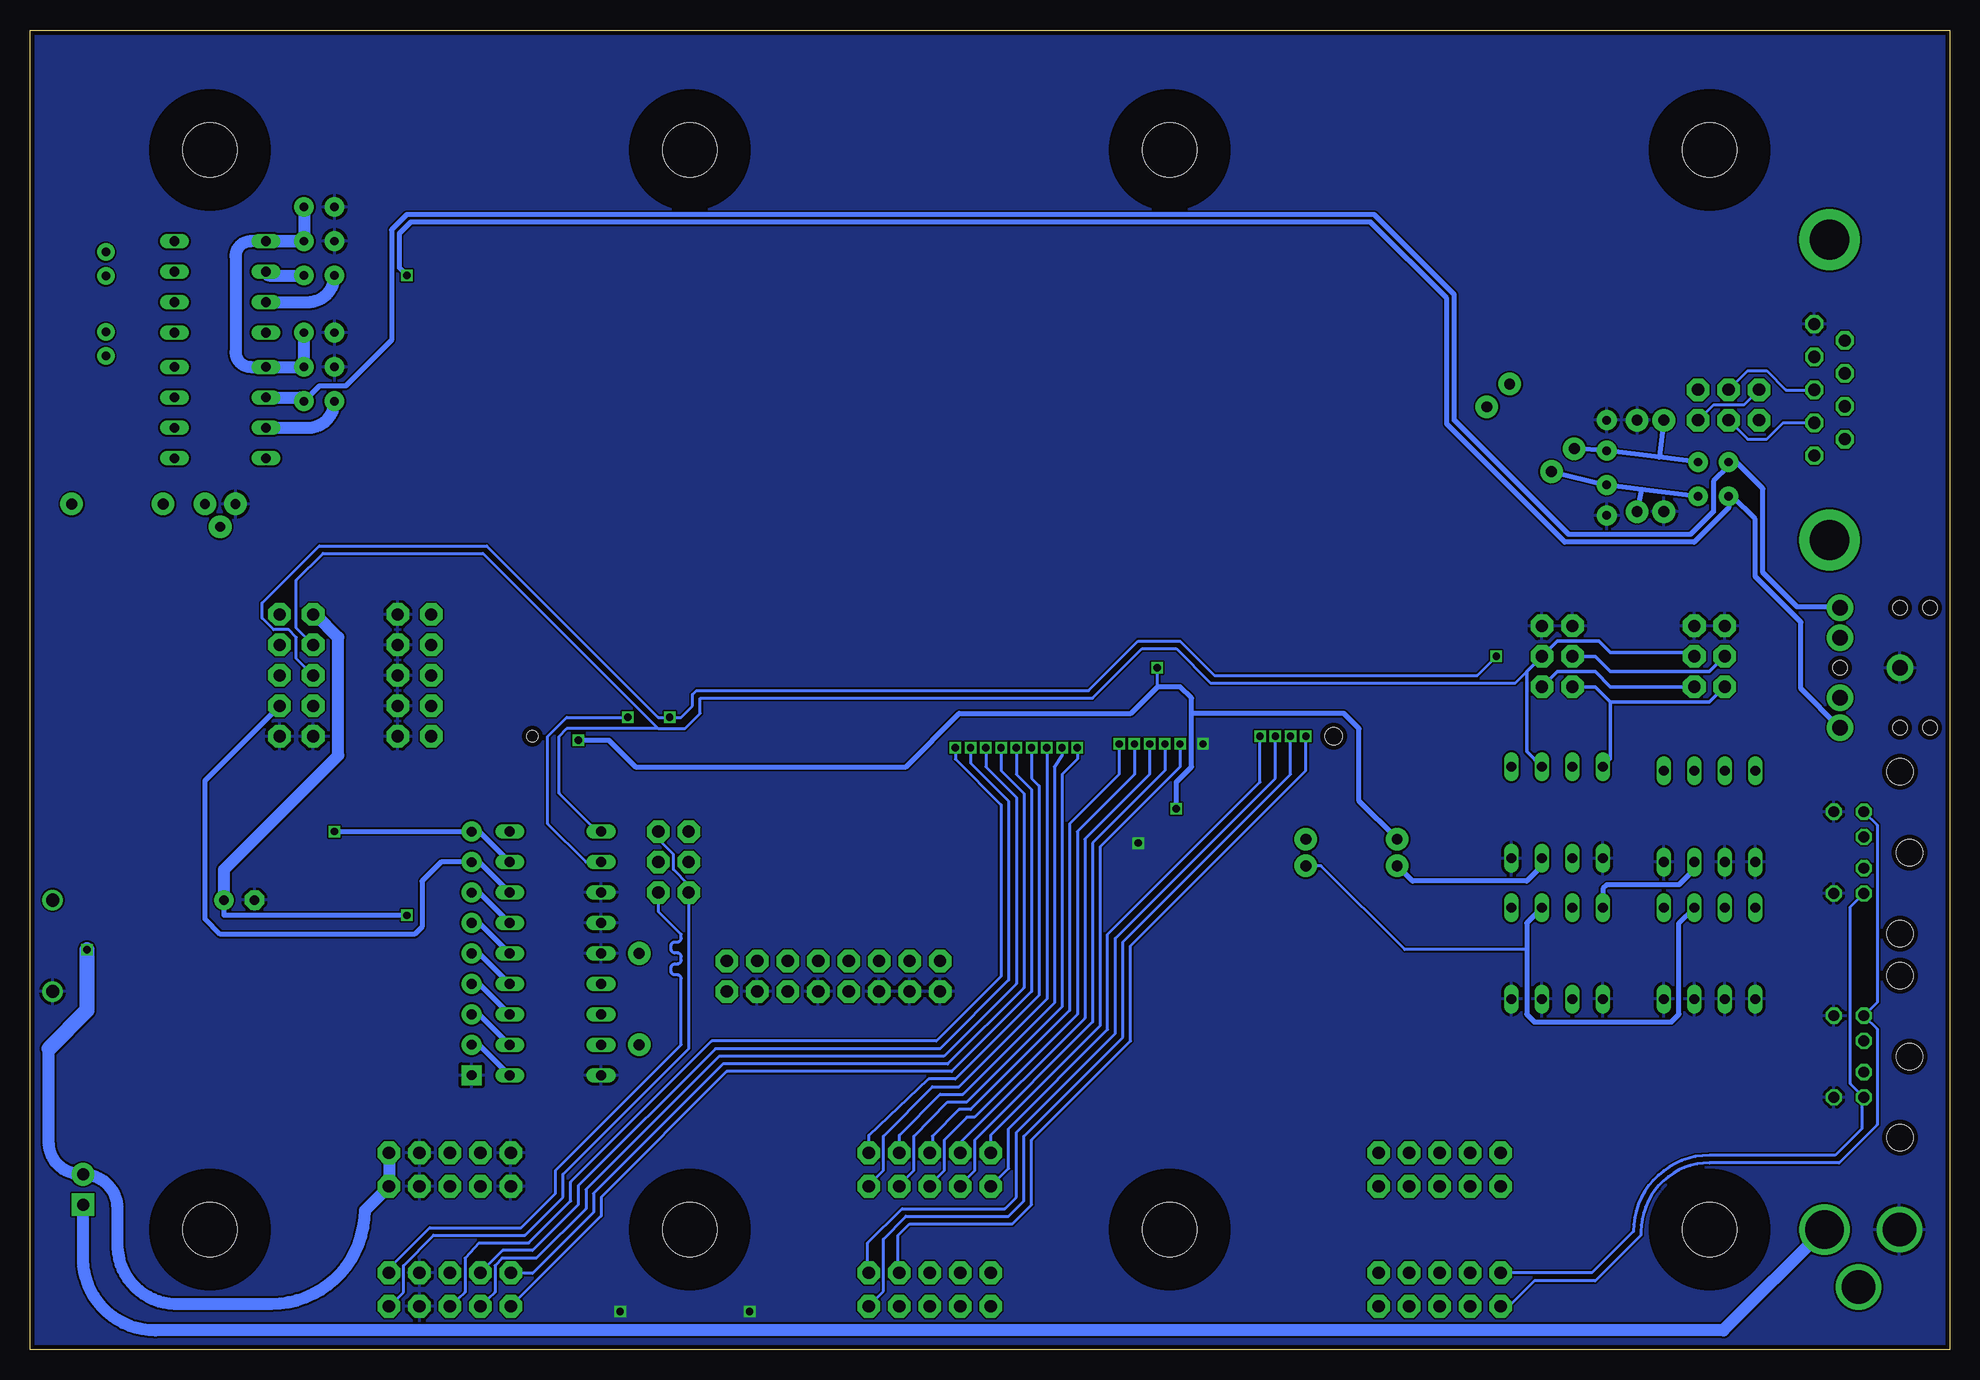
[diagram p7: board, bottom side, seen from below]

Size 160 x 110 mm. Coordinates in mm from the lower left corner, seen from the top.
Outline: 160,0 160,110 0,110 0,0 160,0
Copper layers (1*16): Top 0.0356mm / dielectric 1.5011mm / Bottom 0.0356mm
Design rules "LaenPCBOrder": minimum track width 6mil, minimum drill 13mil, track to track 6mil, track to pad 6mil, pad to pad 6mil, via to via 6mil, smd to smd 6mil, copper to edge 15mil, drill to drill 6mil, minimum pad ring 7mil, minimum via ring 7mil, stop-mask expansion 3mil, vias tented up to drill 0mil, thermal gap 10mil

### Footprints (pad centres in the part's own frame; a part is rotated, then mirrored left to right if it is on the bottom)
AUDIO-JACK = drill 1.3 pad 2.184: RING 5,5; RSH 5,2.5; SLEEVE 0,0; TIP 5,-5; TSH 5,-2.5 | hole 1.2: 0,5; -2.5,5; -2.5,-5; 0,-5; 5,0
E2,5-6 = drill 0.813 pad 1.6: + -1.27,0 | drill 0.813 pad 1.6 octagon: - 1.27,0
1206 = smd 1.6 x 1.8: 1 -1.4,0; 2 1.4,0
CAP-PTH-SMALLEZ = drill 0.7 pad 1.651: 1 0,0; 2 2.54,0
2X8 = drill 1.016 pad 1.88 octagon: 1 0,0; 2 0,2.54; 3 2.54,0; 4 2.54,2.54; 5 5.08,0; 6 5.08,2.54; 7 7.62,0; 8 7.62,2.54; 9 10.16,0; 10 10.16,2.54; 11 12.7,0; 12 12.7,2.54; 13 15.24,0; 14 15.24,2.54; 15 17.78,0; 16 17.78,2.54
DCJACK_2MM_PTH = drill 2.8: GND 0,7.35; GNDBREAK 4.8,10.75 | drill 3.2: PWR 0,13.6
DO41-7.6 = drill 1.1 pad 1.7: A 3.81,0; C -3.81,0
2X5-SHROUDED_LOCK = drill 1.016 pad 1.88 octagon: 1 -1.397,5.08; 2 1.397,5.08; 3 -1.397,2.54; 4 1.397,2.54; 5 -1.397,0; 6 1.397,0; 7 -1.397,-2.54; 8 1.397,-2.54; 9 -1.397,-5.08; 10 1.397,-5.08
SSV-BC06 = drill 0.9 octagon: 1 1.3,8.5; 2 -1.3,8.5; 3 3.4,8.5; 4 -3.4,8.5; 5 3.4,11; 6 -3.4,11 | hole 2.2: -6.75,5.5; 0,4.7; 6.75,5.5
4,5 = hole 4.5: 0,0
2X3-SHROUDED = drill 1.016 pad 1.88 octagon: 1 -1.27,2.54; 2 1.27,2.54; 3 -1.27,0; 4 1.27,0; 5 -1.27,-2.54; 6 1.27,-2.54
TO263-5 = smd 1.067 x 2.159: 1 -3.404,-5.791; 2 -1.702,-5.791; 3 0,-5.791; 4 1.702,-5.791; 5 3.404,-5.791 | smd 10.8 x 10.41: 6 0,2.54
SOT223 = smd 1.499 x 2.007: 1 -2.261,-3.15; 2 0.025,-3.15; 3 2.311,-3.15 | smd 3.81 x 2.007: 4 0,3.15
DIL18 = drill 0.813 long: 1 -10.16,-3.81; 2 -7.62,-3.81; 3 -5.08,-3.81; 4 -2.54,-3.81; 5 0,-3.81; 6 2.54,-3.81; 7 5.08,-3.81; 8 7.62,-3.81; 9 10.16,-3.81; 10 10.16,3.81; 11 7.62,3.81; 12 5.08,3.81; 13 2.54,3.81; 14 0,3.81; 15 -2.54,3.81; 16 -5.08,3.81; 17 -7.62,3.81; 18 -10.16,3.81
SRU1038 = smd 1.8 x 3.6: 1 -4.5,0; 2 4.5,0
MOLEX-1X2 = drill 1.016 pad 1.88 square: 1 0,0 | drill 1.016 pad 1.88: 2 2.54,0
TO-92 = drill 0.813 pad 1.88: 1 -1.27,0; 2 0,1.905; 3 1.27,0
AXIAL-0.3EZ = drill 0.9 pad 1.88: P$1 -3.81,0; P$2 3.81,0
RPACK-SIP-PTH-8 = drill 0.8 pad 1.676 square: P$1 0,0 | drill 0.8 pad 1.676: P$2 0,-2.54; P$3 0,-5.08; P$4 0,-7.62; P$5 0,-10.16; P$6 0,-12.7; P$7 0,-15.24; P$8 0,-17.78; P$9 0,-20.32
DIL8 = drill 0.813 long: 1 -3.81,-3.81; 2 -1.27,-3.81; 3 1.27,-3.81; 4 3.81,-3.81; 5 3.81,3.81; 6 1.27,3.81; 7 -1.27,3.81; 8 -3.81,3.81
F09HP = drill 1.016 octagon: 1 -5.486,-1.27; 2 -2.743,-1.27; 3 0,-1.27; 4 2.743,-1.27; 5 5.486,-1.27; 6 -4.115,1.27; 7 -1.372,1.27; 8 1.372,1.27; 9 4.115,1.27 | drill 3.302 pad 5.08: G1 -12.522,0; G2 12.522,0
2X3 = drill 1.016 pad 1.88 octagon: 1 0,0; 2 0,2.54; 3 2.54,0; 4 2.54,2.54; 5 5.08,0; 6 5.08,2.54
JST-2-PTH-KIT = drill 0.7 pad 1.448: 1 -1,0; 2 1,0
1-1376408-4 = smd 0.35 x 2: 1 -32.65,-4.1; 2 -32.35,4.1; 3 -32.05,-4.1; 4 -31.75,4.1; 5 -31.45,-4.1; 6 -31.15,4.1; 7 -30.85,-4.1; 8 -30.55,4.1; 9 -30.25,-4.1; 10 -29.95,4.1; 11 -29.65,-4.1; 12 -29.35,4.1; 13 -29.05,-4.1; 14 -28.75,4.1; 15 -28.45,-4.1; 16 -28.15,4.1; 17 -27.85,-4.1; 18 -27.55,4.1; 19 -27.25,-4.1; 20 -26.95,4.1; 21 -26.65,-4.1; 22 -26.35,4.1; 23 -26.05,-4.1; 24 -25.75,4.1; 25 -25.45,-4.1; 26 -25.15,4.1; 27 -24.85,-4.1; 28 -24.55,4.1; 29 -24.25,-4.1; 30 -23.95,4.1; 31 -23.65,-4.1; 32 -23.35,4.1; 33 -23.05,-4.1; 34 -22.75,4.1; 35 -22.45,-4.1; 36 -22.15,4.1; 37 -21.85,-4.1; 38 -21.55,4.1; 39 -21.25,-4.1; 40 -20.95,4.1; 41 -17.05,-4.1; 42 -16.75,4.1; 43 -16.45,-4.1; 44 -16.15,4.1; 45 -15.85,-4.1; 46 -15.55,4.1; 47 -15.25,-4.1; 48 -14.95,4.1; 49 -14.65,-4.1; 50 -14.35,4.1; 51 -14.05,-4.1; 52 -13.75,4.1; 53 -13.45,-4.1; 54 -13.15,4.1; 55 -12.85,-4.1; 56 -12.55,4.1; 57 -12.25,-4.1; 58 -11.95,4.1; 59 -11.65,-4.1; 60 -11.35,4.1; 61 -11.05,-4.1; 62 -10.75,4.1; 63 -10.45,-4.1; 64 -10.15,4.1; 65 -9.85,-4.1; 66 -9.55,4.1; 67 -9.25,-4.1; 68 -8.95,4.1; 69 -8.65,-4.1; 70 -8.35,4.1; 71 -8.05,-4.1; 72 -7.75,4.1; 73 -7.45,-4.1; 74 -7.15,4.1; 75 -6.85,-4.1; 76 -6.55,4.1; 77 -6.25,-4.1; 78 -5.95,4.1; 79 -5.65,-4.1; 80 -5.35,4.1; 81 -5.05,-4.1; 82 -4.75,4.1; 83 -4.45,-4.1; 84 -4.15,4.1; 85 -3.85,-4.1; 86 -3.55,4.1; 87 -3.25,-4.1; 88 -2.95,4.1; 89 -2.65,-4.1; 90 -2.35,4.1; 91 -2.05,-4.1; 92 -1.75,4.1; 93 -1.45,-4.1; 94 -1.15,4.1; 95 -0.85,-4.1; 96 -0.55,4.1; 97 -0.25,-4.1; 98 0.05,4.1; 99 0.35,-4.1; 100 0.65,4.1; 101 0.95,-4.1; 102 1.25,4.1; 103 1.55,-4.1; 104 1.85,4.1; 105 2.15,-4.1; 106 2.45,4.1; 107 2.75,-4.1; 108 3.05,4.1; 109 3.35,-4.1; 110 3.65,4.1; 111 3.95,-4.1; 112 4.25,4.1; 113 4.55,-4.1; 114 4.85,4.1; 115 5.15,-4.1; 116 5.45,4.1; 117 5.75,-4.1; 118 6.05,4.1; 119 6.35,-4.1; 120 6.65,4.1; 121 6.95,-4.1; 122 7.25,4.1; 123 7.55,-4.1; 124 7.85,4.1; 125 8.15,-4.1; 126 8.45,4.1; 127 8.75,-4.1; 128 9.05,4.1; 129 9.35,-4.1; 130 9.65,4.1; 131 9.95,-4.1; 132 10.25,4.1; 133 10.55,-4.1; 134 10.85,4.1; 135 11.15,-4.1; 136 11.45,4.1; 137 11.75,-4.1; 138 12.05,4.1; 139 12.35,-4.1; 140 12.65,4.1; 141 12.95,-4.1; 142 13.25,4.1; 143 13.55,-4.1; 144 13.85,4.1; 145 14.15,-4.1; 146 14.45,4.1; 147 14.75,-4.1; 148 15.05,4.1; 149 15.35,-4.1; 150 15.65,4.1; 151 15.95,-4.1; 152 16.25,4.1; 153 16.55,-4.1; 154 16.85,4.1; 155 17.15,-4.1; 156 17.45,4.1; 157 17.75,-4.1; 158 18.05,4.1; 159 18.35,-4.1; 160 18.65,4.1; 161 18.95,-4.1; 162 19.25,4.1; 163 19.55,-4.1; 164 19.85,4.1; 165 20.15,-4.1; 166 20.45,4.1; 167 20.75,-4.1; 168 21.05,4.1; 169 21.35,-4.1; 170 21.65,4.1; 171 21.95,-4.1; 172 22.25,4.1; 173 22.55,-4.1; 174 22.85,4.1; 175 23.15,-4.1; 176 23.45,4.1; 177 23.75,-4.1; 178 24.05,4.1; 179 24.35,-4.1; 180 24.65,4.1; 181 24.95,-4.1; 182 25.25,4.1; 183 25.55,-4.1; 184 25.85,4.1; 185 26.15,-4.1; 186 26.45,4.1; 187 26.75,-4.1; 188 27.05,4.1; 189 27.35,-4.1; 190 27.65,4.1; 191 27.95,-4.1; 192 28.25,4.1; 193 28.55,-4.1; 194 28.85,4.1; 195 29.15,-4.1; 196 29.45,4.1; 197 29.75,-4.1; 198 30.05,4.1; 199 30.35,-4.1; 200 30.65,4.1 | smd 4.5 x 4.6: M1 -33.55,12; M2 31.55,12 | hole 1.45: -34.4,0 | hole 0.95: 32.4,0
DIL08 = drill 0.813 long: 1 -3.81,-3.81; 2 -1.27,-3.81; 3 1.27,-3.81; 4 3.81,-3.81; 5 3.81,3.81; 6 1.27,3.81; 7 -1.27,3.81; 8 -3.81,3.81

### Placement (x,y rotation side)
AUDIO  4.13,56.83 0 top
C1  142.56,37.47 180 top
C2  134.62,31.43 0 top
C3  134.62,33.66 0 top
C4  139.7,31.43 180 top
C5  139.7,33.66 180 top
C6  20.95,73.98 180 top
C7  20.95,71.12 180 top
C8  28.57,74.93 90 top
C9  28.57,72.07 270 top
C10  137.16,92.39 180 top
C11  137.16,95.25 180 top
C12  137.16,89.53 180 top
C13  137.16,81.92 180 top
C14  137.16,84.77 180 top
C15  137.16,79.06 180 top
C16  127.32,44.13 180 top
C17  127.32,41.91 180 top
CHEATER  84.14,29.84 0 top
CN1  -3.17,10 270 top
D1  158.12,33.66 270 top
EXP1  42.5,5 90 top
EXP2  42.5,15 90 top
EXP3  85,5 90 top
EXP4  85,15 90 top
EXP5  125,5 90 top
EXP6  125,15 90 top
EXT_I2C_1  -1.36,41.43 270 top
EXT_I2C_2  -1.36,24.43 270 top
FRONTPANEL  137.79,56.2 0 top
H1  65,10 90 top
H2  145,10 90 top
H3  65,100 90 top
H4  145,100 90 top
H5  20,10 90 top
H6  105,10 90 top
H7  20,100 90 top
H8  105,100 90 top
I2C_1  20,57.78 180 top
I2C_2  32.7,57.78 180 top
IC1  151.45,25.08 180 top
IC2  133.35,25.08 180 top
IC3  140.97,25.08 180 top
IC4  116.2,33.02 270 top
IC5  128.59,36.2 180 top
L1  151.13,37.47 180 top
PWR_SWITCH  155.57,12.06 90 top
Q2  144.15,70.48 180 top
R1  49.85,40.32 180 top
R2  49.85,42.55 180 top
R3  23.81,73.66 90 top
R4  26.04,73.66 270 top
R5  33.97,77.79 225 top
R6  35.88,75.88 225 top
R7  123.19,22.86 180 top
R8  152.72,70.48 180 top
R9  109.22,29.21 90 top
ROM1  20,33.02 0 top
ROM2  20,44.45 0 top
ROM3  32.7,33.02 0 top
ROM4  32.7,44.77 0 top
SERIAL1  10,80 90 top
SERIAL1_PORTFLIP  15.88,77.47 0 top
SPKR_L  153.67,90.49 270 top
SPKR_R  153.67,83.82 270 top
U1  85.72,51.12 0 top
U$1  144.15,88.58 270 top
U$2  144.15,78.11 270 top
USB_POLARITY  105.09,43.18 270 top
VIDEOCORE_JTAG  127.95,56.2 0 top

### Tracks (layer width: path | path; a pad name or v marks a point on that pad's centre or on a via)
1.8V
  Top 0.254: U1.186 112.17,51.22 111.76,50.8 | 111.76,50.8 111.28,50.31 U1.183 | U1.185 111.88,50.69 111.76,50.8 | 111.76,50.8 111.58,50.98 U1.184 111.76,55.4 111.76,56.52 112.39,57.15 117.79,57.15 128.91,46.04 130.81,46.04 130.81,44.13 141.1,33.84 C5.1
  Top 1.016: IC3.2 140.94,31.28 C4.1 C5.1
3.3V  (via drill 0.6)
  Top 0.254: 133.67,34.1 C3.1 | U1.41 U1.39 | U1.39 64.45,46.99 | R9.P$1 109.22,27.62 110.81,29.21 114.3,29.21 116.2,31.11 | IC4.18 117.79,43.18 116.2,41.59 116.2,31.11 | 116.2,31.11 118.11,29.21 124.14,29.21 126.36,26.99 126.68,26.99
  Top 0.406: ROM3.2 31.43,30.8 28.89,33.34 ROM3.8 28.89,38.42 ROM4.2 | ROM4.2 ROM4.3 | ROM4.8 28.89,43.5 ROM4.2 | ROM2.8 21.27,43.18 ROM2.3 21.27,40.01 20,38.73 17.14,38.73 16.19,37.78 ROM1.8 | 133.67,34.1 133.67,40.32 130.18,43.81 130.18,45.4 128.59,45.4 124.46,49.53 115.57,49.53 v114.3,50.8 | U1.40 66.04,55.22 | 66.04,55.22 U1.42 | U1.41 U1.39 | 64.45,46.99 v64.45,45.09 | v66.04,56.83 66.04,55.22 | R2.P$2 R1.P$2
  Top 1.016: C3.1 C2.1 133.32,31.33 133.32,30.16 | IC2.2 133.32,30.16 | 133.32,30.16 129.86,30.16 126.68,26.99 125,25.3 EXP6.6 EXP6.5
  Bottom 0.254: 66.01,55.24 66.04,55.22 v66.04,56.83
  Bottom 0.305: I2C_1.2 20,53.98 28.26,53.98 | 28.26,53.98 29.53,55.24 I2C_2.2 | 28.26,53.98 28.26,49.21 ROM4.8
  Bottom 0.406: ROM2.3 21.27,40.01 22.54,38.73 28.57,38.73 28.89,38.42 ROM3.8 | v64.45,45.09 64.45,47.31 63.18,48.58 63.18,53.02 | 63.18,53.02 63.18,54.29 64.14,55.24 66.01,55.24 | v114.3,50.8 111.76,50.8 109.54,48.58 87,48.58 82.55,53.02 68.23,53.02 66.04,55.22 | ROM4.3 33.97,40.32 35.24,39.05 44.77,39.05 R1.P$2 | R2.P$2 49.21,45.72 49.21,51.75 50.48,53.02 63.18,53.02
5V  (via drill 0.6)
  Top 0.305: 11.43,38.73 11.43,50.48 17.46,56.52 20,56.52 I2C_1.1
  Top 0.406: IC5.3 126.28,38.51 v128.59,36.2
  Top 1.016: IC1.4 149.75,34.35 L1.2 C1.+ 143.83,31.75 145.1,30.48 145.1,26.99 144.15,26.04 138.43,26.04 | 138.43,26.04 136.84,26.04 | 136.84,26.04 131.13,26.04 131.04,26.12 IC2.3 | IC3.3 138.66,26.26 138.43,26.04 | EXP6.3 EXP6.4 122.46,13.11 123.83,11.75 130.81,11.75 131.29,12.22 | 131.29,12.22 137.16,18.1 137.16,25.72 136.84,26.04 | EXT_I2C_2.2 EXT_I2C_2.1 10.16,23.13 | EXT_I2C_1.2 EXT_I2C_1.1 10.04,40.13 11.43,38.73 11.43,24.4 10.16,23.13 | 131.29,12.22 132.08,11.43 132.08,1.59 18.73,1.59 13.65,6.67 13.65,16.61 11.43,18.83 11.43,21.91 10.21,23.13 10.16,23.13 | FRONTPANEL.1 136.4,73.79 132.72,77.47 132.72,86.04 133.35,86.68 136.84,86.68 137.16,86.36 C14.1
  Bottom 0.305: I2C_1.1 28.26,55.24 29.53,56.52 32.7,56.52 I2C_2.1
  Bottom 0.406: v128.59,36.2 143.83,36.2 C1.+
  Bottom 1.016: C1.+ 143.83,40.01 134.3,49.53 134.3,59.37 136.21,61.28 FRONTPANEL.1 | U$1.1 C10.1 | C11.1 C10.1 | C14.1 C13.1 U$2.1 141.6,81.92 arc90 142.88,83.19 142.88,91.12 arc90 141.6,92.39 C10.1
AUDIO_GROUND
  Top 1.016: U$1.3 145.41,87.31 | 145.41,87.31 U$1.6 | U$2.3 U$2.6 145.41,76.83 | Q2.1 145.41,76.52 145.41,76.83 | 145.41,76.83 145.41,87.31
  Bottom 1.016: U$1.3 136.84,87.31 arc-90 C12.2 | U$2.3 136.84,76.83 arc-90 C15.2
CPU_3.3V
  Top 0.254: U1.199 U1.197 115.47,45.62 115.25,45.4 113.98,45.4 113.67,45.72 113.67,47.01 U1.191 U1.189 | U1.198 U1.200
  Top 0.406: U1.192 113.97,56.19 | U1.190 U1.192 | U1.192 U1.194 | U1.198 115.89,55.22 115.89,53.66 113.97,53.66 | 113.97,53.66 U1.192 | 113.97,53.66 113.35,53.66 113.35,49.53 | 113.35,49.53 113.35,47.62 113.67,47.62 U1.191 U1.193 | IC5.2 128.56,44.29 | 113.35,49.53 114.62,49.53 115.25,48.9 124.14,48.9 128.56,44.48 128.56,44.29 | 128.56,44.29 C16.1 C17.1
GND  (via drill 0.6)
  Top 1.016: Q2.3 142.56,70.8
  other vias: 100.01,3.17 110.81,3.17 62.23,50.48 67.63,42.23
  pour Bottom: 0,109.86 160.02,109.86 160.02,0 0,0
  pour Top: 0,109.86 160.02,109.86 160.02,0 0,0
GPIO4
  Top 0.254: U1.15 57.27,36.64 56.52,35.88 51.75,35.88 41.91,26.04 39.05,26.04 32.07,19.05 32.07,12.06 35.24,8.89 39.69,8.89 41.23,7.3 41.23,4.83 EXP1.5
GPIO5
  Top 0.254: U1.17 57.88,36.28 56.83,35.24 52.07,35.24 42.23,25.4 39.37,25.4 32.7,18.73 32.7,12.38 35.56,9.53 41.59,9.53 42.5,8.62 EXP1.6
GPIO6
  Top 0.254: U1.21 59.08,35.26 58.42,34.61 52.39,34.61 42.55,24.77 39.69,24.77 33.34,18.41 33.34,12.7 35.88,10.16 41.91,10.16 43.77,8.26 43.77,4.83 EXP1.7
GPIO7
  Top 0.254: U1.23 59.67,34.91 58.74,33.97 52.7,33.97 42.86,24.13 40.01,24.13 33.97,18.1 33.97,13.02 36.2,10.79 42.23,10.79 45.04,7.98 EXP1.8
GPIO8
  Top 0.254: U1.27 60.88,33.89 60.33,33.34 53.02,33.34 43.18,23.5 40.32,23.5 34.61,17.78 34.61,13.34 36.51,11.43 42.55,11.43 46.31,7.62 46.31,4.83 EXP1.9
GPIO9
  Top 0.254: U1.29 61.48,33.53 60.64,32.7 53.34,32.7 43.5,22.86 40.64,22.86 35.24,17.46 35.24,13.65 36.83,12.06 43.5,12.06 47.58,7.98 EXP1.10
GPIO10
  Top 0.254: U1.33 62.67,32.83 61.91,32.07 53.66,32.07 43.81,22.23 40.96,22.23 35.88,17.14 35.88,15.15 EXP2.1
GPIO11
  Top 0.254: U1.35 63.27,32.48 62.23,31.43 53.98,31.43 44.13,21.59 41.59,21.59 37.47,17.46 37.47,16.44 EXP2.2
GPIO12
  Top 0.254: EXP2.3 38.78,13.6 38.69,13.65 38.69,17.46 42.23,20.95 44.45,20.95 54.29,30.8 62.55,30.8 69.85,38.1 69.85,46.99 U1.45
GPIO13
  Top 0.254: 40.01,16.4 EXP2.4 40.01,16.44 40.01,17.46 42.86,20.32 44.77,20.32 54.29,29.84 54.61,30.16 62.87,30.16 70.47,37.77 U1.47
GPIO17
  Top 0.254: EXP2.7 43.77,13.6 43.77,17.46 44.77,18.41 45.72,18.41 55.56,28.26 63.82,28.26 74.08,38.52 U1.59
GPIO18
  Top 0.254: 45.09,16.4 EXP2.8 45.09,16.44 45.09,17.46 45.4,17.78 46.04,17.78 55.56,27.3 55.88,27.62 64.14,27.62 75.28,38.76 U1.63
GPIO19
  Top 0.254: EXP2.9 46.31,13.6 46.31,17.14 56.2,26.99 64.45,26.99 75.88,38.41 U1.65
GPIO20
  Top 0.254: 47.62,16.4 EXP2.10 47.62,16.44 47.62,17.46 56.52,26.35 64.77,26.35 77.08,38.66 U1.69
GPIO21
  Top 0.254: U1.71 77.67,38.3 72.39,33.02 72.39,10.16 75.88,6.67 77.15,6.67 79.92,3.9 EXP3.1
GPIO22
  Top 0.254: U1.75 78.88,38.55 73.03,32.7 73.03,10.48 76.15,7.35 79.01,7.35 79.69,6.67 EXP3.2
GPIO23
  Top 0.254: U1.77 79.47,38.2 73.66,32.38 73.66,10.79 76.52,7.94 80.33,7.94 81.19,6.99 81.19,5.08 82.46,3.9 EXP3.3
GPIO24
  Top 0.254: U1.81 80.67,38.45 74.3,32.07 74.3,11.11 76.83,8.57 81.28,8.57 82.46,7.39 EXP3.4
GPIO25
  Top 0.254: U1.83 81.28,38.09 74.93,31.75 74.93,11.43 77.15,9.21 81.92,9.21 83.73,7.3 83.73,5.08 85,3.9 EXP3.5
GPIO26
  Top 0.254: U1.87 82.47,38.34 75.56,31.43 75.56,11.75 77.47,9.84 82.55,9.84 85.09,7.3 85.09,6.49 EXP3.6
GPIO27
  Top 0.254: U1.89 83.08,37.99 76.2,31.11 76.2,12.06 77.79,10.48 83.19,10.48 86.27,7.3 86.27,5.08 87.54,3.9 EXP3.7
GPIO28  (via drill 0.6)
  Top 0.254: U1.28 61.17,53.34 53.66,53.34 v53.66,51.12
  Bottom 0.254: v53.66,51.12 53.66,48.26 68.26,33.66 68.26,25.72 76.52,17.46 76.52,12.06 78.11,10.48 86.68,10.48 87.63,9.53 87.63,6.4 EXP3.8
GPIO29  (via drill 0.6)
  Top 0.254: U1.30 61.77,52.7 54.93,52.7 v54.93,51.12
  Bottom 0.254: EXP3.9 88.86,4.87 88.86,9.21 87,11.11 78.42,11.11 77.15,12.38 77.15,17.78 68.9,26.04 68.9,33.97 54.93,47.94 v54.93,51.12
GPIO30  (via drill 0.6)
  Top 0.254: U1.34 62.98,52.07 56.2,52.07 v56.2,51.12
  Bottom 0.254: EXP3.10 90.17,6.4 90.17,8.89 87.31,11.75 78.74,11.75 77.79,12.7 77.79,18.1 69.53,26.35 69.53,34.29 56.2,47.62 v56.2,51.12
GPIO31  (via drill 0.6)
  Top 0.254: U1.36 63.58,51.44 57.47,51.44 v57.47,51.12
  Bottom 0.254: EXP4.1 78.42,15.1 78.42,18.41 70.17,26.67 70.17,34.61 57.47,47.31 v57.47,51.12
GPIO32  (via drill 0.6)
  Top 0.254: v64.14,50.48 64.14,53.66 69.85,53.66 70.17,53.98 U1.46
  Bottom 0.254: v64.14,50.48 64.14,48.58 70.8,41.91 70.8,26.99 79.92,17.87 EXP4.2
GPIO33  (via drill 0.6)
  Top 0.254: v65.41,50.48 65.41,53.02 70.17,53.02 70.78,53.63 U1.48
  Bottom 0.254: EXP4.3 82.46,13.74 81.23,14.92 81.23,17.46 71.44,27.3 71.44,42.23 65.41,48.26 v65.41,50.48
GPIO34  (via drill 0.6)
  Top 0.254: v66.67,50.48 66.67,52.39 70.48,52.39 71.97,53.88 U1.52
  Bottom 0.254: EXP4.4 82.46,17.23 72.07,27.62 72.07,42.55 66.67,47.94 v66.67,50.48
GPIO35  (via drill 0.6)
  Top 0.254: v67.94,50.48 67.94,51.75 70.8,51.75 72.58,53.52 U1.54
  Bottom 0.254: EXP4.5 85,13.74 83.78,14.92 83.78,17.46 81.92,19.37 81.28,19.37 72.71,27.94 72.71,43.18 67.94,47.94 v67.94,50.48
GPIO36  (via drill 0.6)
  Top 0.254: U1.58 73.78,53.77 71.12,51.12 69.22,51.12 v69.22,50.48
  Bottom 0.254: v69.22,50.48 69.22,47.94 73.34,43.81 73.34,28.26 81.6,20 82.55,20 84.77,17.78 84.77,16.62 EXP4.6
GPIO37  (via drill 0.6)
  Top 0.254: U1.60 74.38,53.42 72.71,51.75 v72.71,50.16
  Bottom 0.254: EXP4.7 87.54,13.74 86.31,14.92 86.31,17.78 83.5,20.64 81.92,20.64 73.98,28.57 73.98,47.94 72.71,49.21 v72.71,50.16
GPIO38  (via drill 0.6)
  Top 0.254: U1.64 75.56,52.7 73.99,51.13 73.99,50.81 v73.98,50.16
  Bottom 0.254: EXP4.8 87.54,17.87 84.14,21.27 82.23,21.27 74.61,28.89 74.61,48.58 73.98,49.53 v73.98,50.16
GPIO39  (via drill 0.6)
  Top 0.254: U1.66 76.17,51.73 75.25,50.8 v75.25,50.16
  Bottom 0.254: EXP4.9 90.08,13.74 88.86,14.92 88.86,17.78 84.77,21.91 82.55,21.91 75.25,29.21 v75.25,50.16
GPIO40  (via drill 0.6)
  Top 0.254: v76.52,50.16 76.52,50.8 77.38,51.66 U1.70 77.38,56.61 75.56,58.42 63.5,58.42 55.88,66.04 50.16,66.04 39.37,76.83 37.78,76.83 36.67,77.95 R5.P$1
  Bottom 0.254: EXP4.10 90.08,17.87 85.09,22.54 82.87,22.54 75.88,29.53 75.88,46.99 76.52,47.62 v76.52,50.16
GPIO41  (via drill 0.6)
  Top 0.254: v77.79,50.16 77.79,50.8 77.97,50.99 U1.72 77.97,56.96 75.88,59.05 63.82,59.05 56.2,66.67 50.47,66.67 R6.P$1
  Bottom 0.254: v77.79,50.16 77.79,47.94 76.52,46.67 76.52,29.84 83.19,23.18 101.92,23.18 112.39,12.7 112.39,11.13 EXP5.1
GPIO42  (via drill 0.6)
  Top 0.254: U1.76 79.17,50.28 v79.06,50.16
  Bottom 0.254: v79.06,50.16 79.06,48.26 77.15,46.35 77.15,30.16 83.5,23.81 102.23,23.81 113.03,13.02 113.03,11.43 118.11,6.35 119.87,6.35 EXP5.2
GPIO43  (via drill 0.6)
  Top 0.254: U1.78 79.78,51.35 80.33,50.8 v80.33,50.16
  Bottom 0.254: v80.33,50.16 80.33,48.58 77.79,46.04 77.79,30.48 83.82,24.45 102.55,24.45 113.67,13.34 113.67,11.75 117.79,7.62 120.65,7.62 121.24,6.99 121.24,4.78 EXP5.3
GPIO44  (via drill 0.6)
  Top 0.254: U1.82 80.97,51.42 81.6,50.8 v81.6,50.16
  Bottom 0.254: v81.6,50.16 81.6,48.9 78.42,45.72 78.42,30.8 84.14,25.08 102.87,25.08 114.3,13.65 114.3,12.06 118.11,8.26 120.6,8.26 EXP5.4
GPIO45  (via drill 0.6)
  Top 0.254: U1.84 81.58,52.09 82.87,50.8 v82.87,50.16
  Bottom 0.254: v82.87,50.16 82.87,49.21 79.06,45.4 79.06,31.11 84.45,25.72 103.19,25.72 114.94,13.97 114.94,12.38 118.43,8.89 122.56,8.89 123.73,7.62 123.73,4.78 EXP5.5
HDMI_CEC
  Top 0.152: CHEATER.15 101.92,28.26 102.55,27.62 104.14,27.62 107.31,30.8 107.31,34.92 109.54,37.15 109.54,44.13 108.58,45.09 107.95,45.09 107.67,45.36 107.67,45.99
  Top 0.254: U1.171 107.67,45.99
HDMI_CK_N
  Top 0.152: U1.111 89.67,39.09 84.98,34.4 84.98,33.23 CHEATER.2
HDMI_CK_P
  Top 0.152: U1.113 90.28,39.26 85.52,34.5 85.52,33.55 CHEATER.4
HDMI_D0_N
  Top 0.152: U1.117 91.47,35.81 90.06,34.4 90.06,33.23 CHEATER.6
HDMI_D0_P
  Top 0.152: U1.119 92.08,35.98 90.59,34.5 90.59,33.55 CHEATER.8
HDMI_D1_N
  Top 0.152: U1.123 93.28,36.68 95.14,34.82 94.3,33.97 CHEATER.10
HDMI_D1_P
  Top 0.152: U1.125 93.88,36.52 96.84,33.55 CHEATER.12
HDMI_D2_N
  Top 0.152: U1.129 95.08,39.33 100.54,33.87 100.54,33.55 CHEATER.14
HDMI_D2_P
  Top 0.152: U1.131 95.67,39.16 101.07,33.76 101.07,33.23 CHEATER.16
HDMI_SCL
  Top 0.152: U1.175 108.88,45.75 108.9,45.72 109.22,45.72 110.17,44.77 110.17,36.51 107.95,34.29 107.95,30.16 104.78,26.99 93.03,26.99 91.76,28.26 CHEATER.7
HDMI_SDA
  Top 0.152: U1.173 108.28,45.71 108.58,45.4 108.9,45.4 109.86,44.45 109.86,36.83 107.63,34.61 107.63,30.48 104.46,27.3 97.79,27.3 96.84,28.26 CHEATER.11
IO_RST
  Top 0.254: IC4.6 111.76,30.48 R9.P$2
LED_NOTIFICATION
  Bottom 0.406: IC4.16 122.56,40.64 R7.P$8 125.73,40.64 127.32,39.05 127.32,35.24 127.95,34.61 144.15,34.61 145.41,35.88 145.41,47.43 FRONTPANEL.8
LOUT_L  (via drill 0.6)
  Top 0.406: v128.59,89.53 132.08,89.53 133.35,90.81 135.89,90.81 C12.1
  Bottom 0.406: AUDIO.TIP 12.38,55.09 12.38,60.64 16.19,64.45 16.19,69.22 18.1,71.12 C7.2 18.41,70.17 21.27,67.31 32.07,67.31 41.91,77.15 41.91,87.63 48.26,93.98 128.27,93.98 129.22,93.03 129.22,90.17 v128.59,89.53
  Bottom 1.016: U$1.2 arc-90 140.02,89.53 C12.1
LOUT_R
  Bottom 0.406: AUDIO.RING 9.21,61.91 12.7,61.91 15.56,64.77 15.56,71.75 17.78,73.98 C6.2 18.41,73.66 19.68,72.39 19.68,69.85 21.59,67.94 31.75,67.94 41.27,77.47 41.27,87.95 47.94,94.61 128.59,94.61 129.86,93.34 129.86,84.14 133.67,80.33 135.89,80.33 C15.1
  Bottom 1.016: U$2.2 137.48,79.38 arc90 C15.1
N$1
  Top 0.254: U1.180 110.38,57.03 111.12,57.78 118.11,57.78 124.78,51.12 VIDEOCORE_JTAG.9
N$2
  Top 0.254: VIDEOCORE_JTAG.7 123.19,53.66 118.43,58.42 111.12,58.42 109.78,57.07 U1.178
N$3
  Top 0.254: VIDEOCORE_JTAG.5 121.6,56.2 118.75,59.05 111.12,59.05 109.17,57.1 U1.176
N$4
  Top 0.254: VIDEOCORE_JTAG.3 120.02,58.74 119.06,59.69 111.12,59.69 108.58,57.14 U1.174
N$5
  Top 0.254: U1.172 107.97,57.17 111.12,60.33 119.38,60.33 120.33,59.37 122.87,59.37 124.78,61.28 VIDEOCORE_JTAG.1
N$8
  Bottom 1.016: CN1.PWR 18.84,1.59 149.54,1.59 arc90 155.57,7.62 PWR_SWITCH.1
N$10
  Top 1.016: U$1.5 148.59,84.77 arc90 150.5,86.68 150.5,87.63 arc-90 152.08,89.22 153.4,89.22 arc90 SPKR_L.2
N$11
  Top 1.016: U$1.8 152.76,92.39 arc-90 SPKR_L.1
N$12
  Top 1.016: Q2.2 147,68.58 R8.P$2
N$16
  Bottom 0.406: R7.P$7 122.56,38.1 IC4.15
N$17
  Bottom 0.406: R7.P$6 122.56,35.56 IC4.14
N$18
  Bottom 0.406: R7.P$5 122.56,33.02 IC4.13
N$19
  Bottom 0.406: R7.P$4 122.56,30.48 IC4.12
N$20
  Bottom 0.406: R7.P$3 122.56,27.94 IC4.11
N$21
  Bottom 0.406: R7.P$2 122.56,25.4 IC4.10
N$22
  Top 1.016: U$2.5 149.22,74.3 arc90 151.76,76.83 151.76,80.92 arc-90 SPKR_R.2
N$23
  Top 1.016: U$2.8 149.54,81.92 arc90 150.5,82.87 150.5,83.5 arc-90 151.76,84.77 153.62,84.77 arc90 SPKR_R.1
PORT_RX
  Bottom 0.254: SERIAL1_PORTFLIP.3 16.83,75.88 15.24,75.88 13.87,77.26 SERIAL1.2
PORT_TX
  Bottom 0.254: SERIAL1_PORTFLIP.4 16.83,81.6 15.24,81.6 13.64,80 SERIAL1.3
PWM0_R
  Bottom 0.406: C6.1 24.2,74.38 | 24.2,74.38 C8.1 R5.P$2 | R3.P$2 24.2,74.38
PWM1_L
  Bottom 0.406: C7.1 25.64,71.71 | 25.64,71.71 C9.1 R6.P$2 | R4.P$2 25.64,71.71
RXD0
  Top 0.254: 42.55,16.4 EXP2.6 42.55,16.44 42.55,17.46 44.13,19.05 45.4,19.05 55.24,28.89 63.5,28.89 72.28,37.67 U1.53 72.28,49.01 71.75,49.53 61.59,49.53 61.28,49.85 50.48,49.85 48.26,52.07 48.26,63.82 32.07,80.01 SERIAL1_PORTFLIP.6 19.68,78.74 17.14,78.74 SERIAL1_PORTFLIP.1
SCL
  Top 0.254: EXP1.2 34.88,6.4 30.16,11.11 30.16,20 38.1,27.94 40.96,27.94 50.8,37.78 54.29,37.78 54.93,38.42 54.93,40.32 | 54.93,40.32 54.93,45.09 54.27,45.74 U1.5 | R1.P$1 54.93,40.32
  Top 0.406: ROM3.6 33.97,37.78 35.24,39.05 35.24,47.31 ROM4.6 | ROM1.6 21.27,37.78 22.54,39.05 22.54,46.99 ROM2.6
  Bottom 0.254: EXP1.2 29.8,6.4 26.35,9.84 arc90 20,16.19 9.53,16.19 7.3,18.41 7.3,20.32 7.13,20.49 EXT_I2C_2.3 8.26,22.15 8.26,36.91 EXT_I2C_1.3 | FRONTPANEL.3 137.79,60.13 137.79,64.14 135.57,66.36 122.24,66.36 107.63,51.75 | 107.63,51.75 105.41,51.75 104.14,53.02 104.14,54.29 71.44,54.29 67.31,58.42 64.45,58.42 61.59,55.56 36.2,55.56 35.24,56.52 | IC4.1 112.71,43.18 115.89,46.35 115.89,51.12 115.25,51.75 107.63,51.75 | 35.24,33.34 45.4,33.34 52.39,40.32 R1.P$1
  Bottom 0.305: I2C_1.3 21.59,58.1 28.26,58.1 29.21,59.05 32.7,59.05 I2C_2.3 35.24,56.52 35.24,49.85 ROM4.6
  Bottom 0.406: ROM3.6 35.24,35.56 35.24,33.34 35.24,27.94 34.61,27.3 23.18,27.3 22.54,27.94 22.54,35.56 ROM1.6
SCL1
  Top 0.254: U1.11 56.08,37.66 54.93,36.51 51.44,36.51 41.59,26.67 38.73,26.67 31.43,19.37 31.43,11.75 34.92,8.26 39.37,8.26 39.96,7.67 EXP1.4
SDA  (via drill 0.6)
  Top 0.254: 45.4,33.34 50.48,38.42 51.12,38.42 52.07,39.37 52.07,40.96 R2.P$1 53.67,42.56 U1.3 | 45.4,33.34 40.64,28.57 37.78,28.57 29.53,20.32 29.53,10.79 36.72,3.6 EXP1.1 | v37.78,57.78 36.51,57.78 34.92,56.2 | v106.68,52.7 v110.17,52.7 | 35.24,33.34 45.4,33.34
  Top 0.305: I2C_2.4 32.7,56.52 34.61,56.52 34.92,56.2 35.24,55.88 35.24,49.85 ROM4.5
  Top 0.406: ROM4.5 36.51,43.5 37.78,42.23 37.78,39.05 36.51,37.78 ROM3.5 35.24,35.56 35.24,33.34 35.24,27.94 34.61,27.3 23.18,27.3 22.54,27.94 22.54,35.56 ROM1.5 23.81,37.78 25.08,39.05 25.08,41.91 23.81,43.18 ROM2.5
  Bottom 0.254: EXP1.1 36.72,3.6 34.61,5.71 29.53,5.71 25.72,9.53 25.72,9.84 arc90 20,15.56 9.21,15.56 6.03,18.73 6.03,26.73 EXT_I2C_2.4 6.03,28.93 6.03,43.73 EXT_I2C_1.4 | FRONTPANEL.5 137.79,57.59 137.79,59.37 138.43,60.01 139.7,60.01 140.65,60.96 140.65,62.23 135.89,66.99 121.92,66.99 107.63,52.7 v106.68,52.7 105.73,52.7 104.78,53.66 104.78,54.61 104.46,54.93 71.75,54.93 67.63,59.05 64.14,59.05 61.28,56.2 39.37,56.2 v37.78,57.78 | IC4.2 113.67,40.64 116.84,43.81 116.84,51.12 115.25,52.7 v110.17,52.7
  Bottom 0.305: I2C_1.4 20,56.52 28.26,56.52 29.53,57.78 I2C_2.4
SDA1
  Top 0.254: U1.9 55.48,38.01 54.61,37.15 51.12,37.15 41.27,27.3 38.42,27.3 30.8,19.68 30.8,11.43 34.61,7.7 38.1,7.7 38.69,6.99 38.69,5.08 39.96,3.85 EXP1.3
SPKR_ENABLE  (via drill 0.6)
  Top 0.406: R8.P$1 156.53,60.01 139.7,43.18 v134.62,43.18
  Bottom 0.406: v134.62,43.18 R7.P$9 122.56,43.18 IC4.17
TXD0
  Top 0.254: EXP2.5 41.23,13.6 41.23,17.46 43.5,19.68 45.09,19.68 54.93,29.53 63.18,29.53 71.67,38.02 U1.51 71.67,48.66 71.44,48.9 61.28,48.9 60.96,49.21 50.16,49.21 47.62,51.75 47.62,63.5 31.75,79.38 23.5,79.38 21.59,77.47 SERIAL1_PORTFLIP.5
  Bottom 0.254: SERIAL1_PORTFLIP.2 17.14,78.74 19.68,78.74 SERIAL1_PORTFLIP.5
USB+
  Top 0.254: USB_POLARITY.1 105.09,42.55 106.36,41.27 106.36,40.01 107.63,38.73 USB_POLARITY.6
  Bottom 0.254: EXP5.10 129.86,6.62 129.86,6.99 126.68,10.16 119.06,10.16 116.2,13.02 116.2,14.92 105.73,25.4 105.73,30.92 arc-90 106.05,31.23 106.25,31.23 arc90 106.57,31.55 106.57,31.83 arc90 106.25,32.15 106.05,32.15 arc-90 105.73,32.46 105.73,32.74 arc-90 106.05,33.06 106.25,33.06 arc90 106.57,33.38 106.57,33.66 arc90 106.25,33.97 106.05,33.97 arc-90 105.73,34.29 105.73,34.61 107.63,36.51 USB_POLARITY.6
USB-
  Bottom 0.254: USB_POLARITY.2 107.63,42.55 106.36,41.27 106.36,40.01 105.09,38.73 USB_POLARITY.5 105.09,25.08 115.57,14.61 115.57,12.7 118.75,9.53 126.36,9.53 128.86,6.99 128.86,4.78 EXP5.9
USB_D+
  Top 0.254: U1.165 105.88,45.23 105.09,44.45 104.46,44.45 103.82,43.81 103.82,41.91 USB_POLARITY.3
USB_D-
  Top 0.254: U1.167 106.47,45.61 107.63,44.45 108.27,44.45 108.9,43.81 108.9,41.91 USB_POLARITY.4
V+  (via drill 0.6)
  Top 1.016: IC1.1 154.85,32.93 v155.26,33.34
  Bottom 1.016: EXP6.10 EXP6.9 132.08,11.6 arc90 139.87,3.81 147.96,3.81 arc90 152.72,8.89 152.72,11.75 arc-90 PWR_SWITCH.2 arc90 158.43,17.14 158.43,25.08
  Bottom 1.27: v155.26,33.34 155.26,28.26 158.43,25.08
VOUT
  Top 1.016: IC1.2 153.15,34.98 L1.1 D1.C

### Text on the board
tPlace: I2C A | VIDEO CORE / JTAG | FRONT / PANEL | I2C B | REAR | I2C EXPANSION CARD | EXP2 | EXP4 | EXP6 | EXP1 | EXP3 | EXP5
tNames: POWER / SWITCH